# EAGLE design seletor (EAGLE 7.6.0)

## Sheet 1 of 2
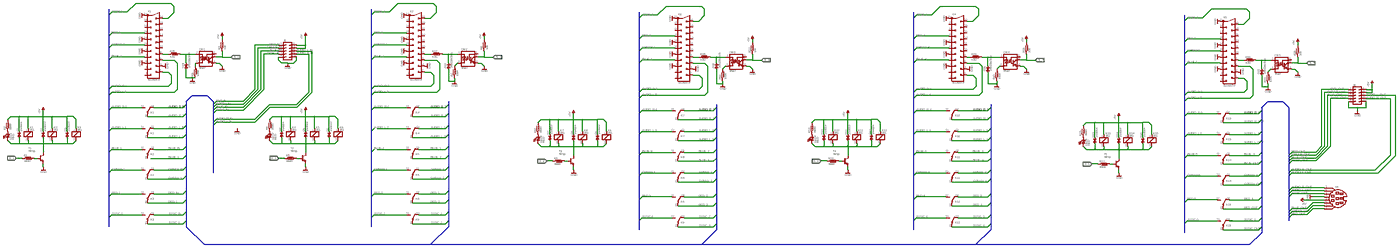
[diagram p0: schematic, sheet 1, overview]
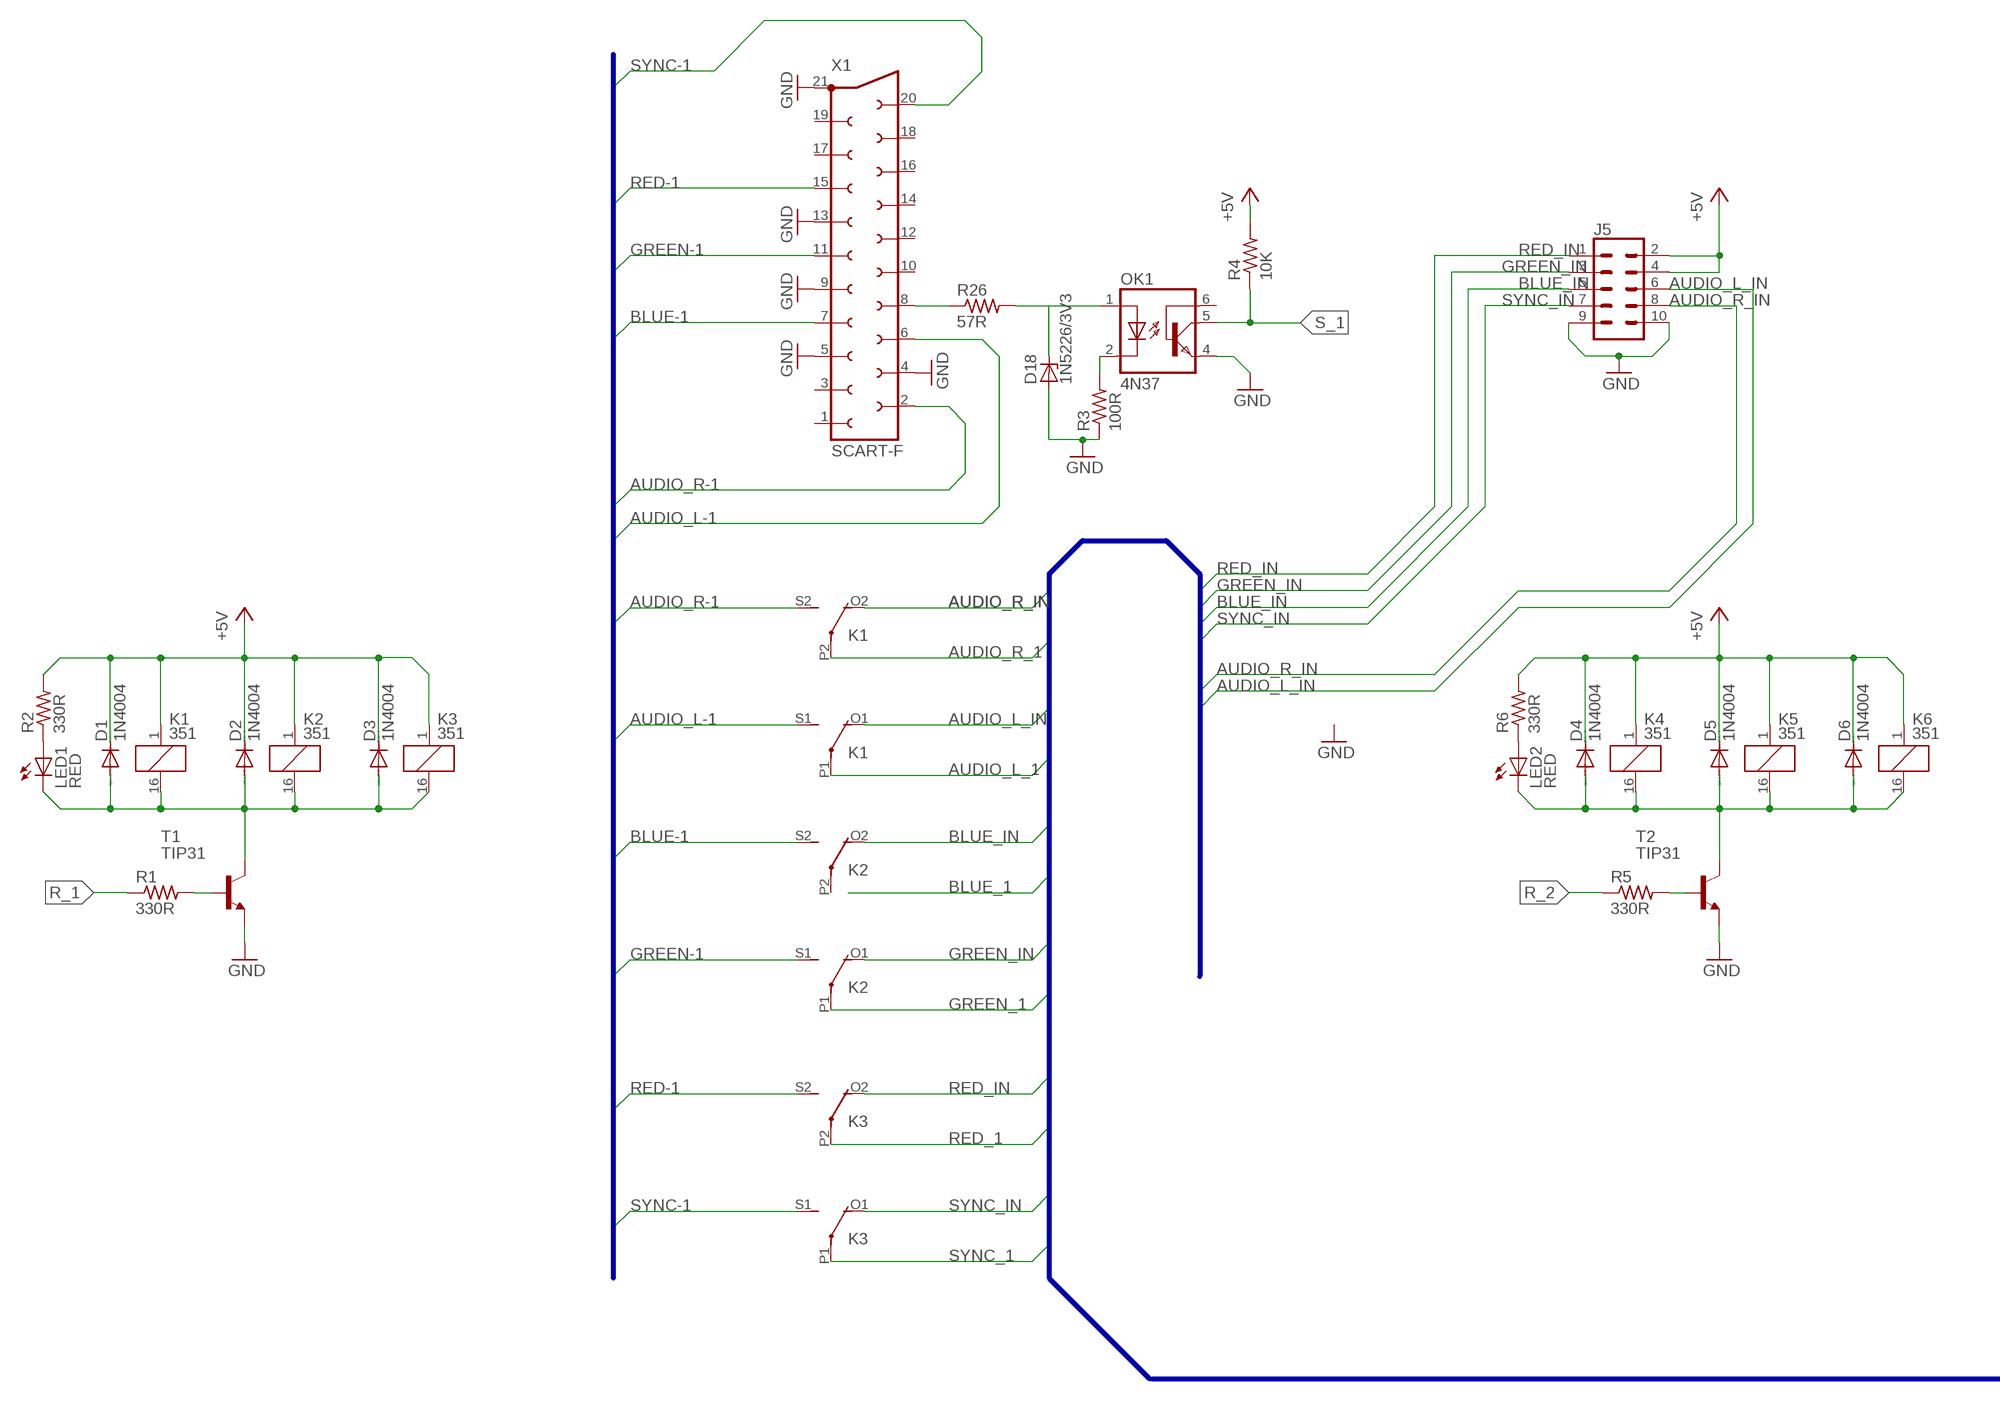
[diagram p1: schematic, sheet 1, part 1 of 4]
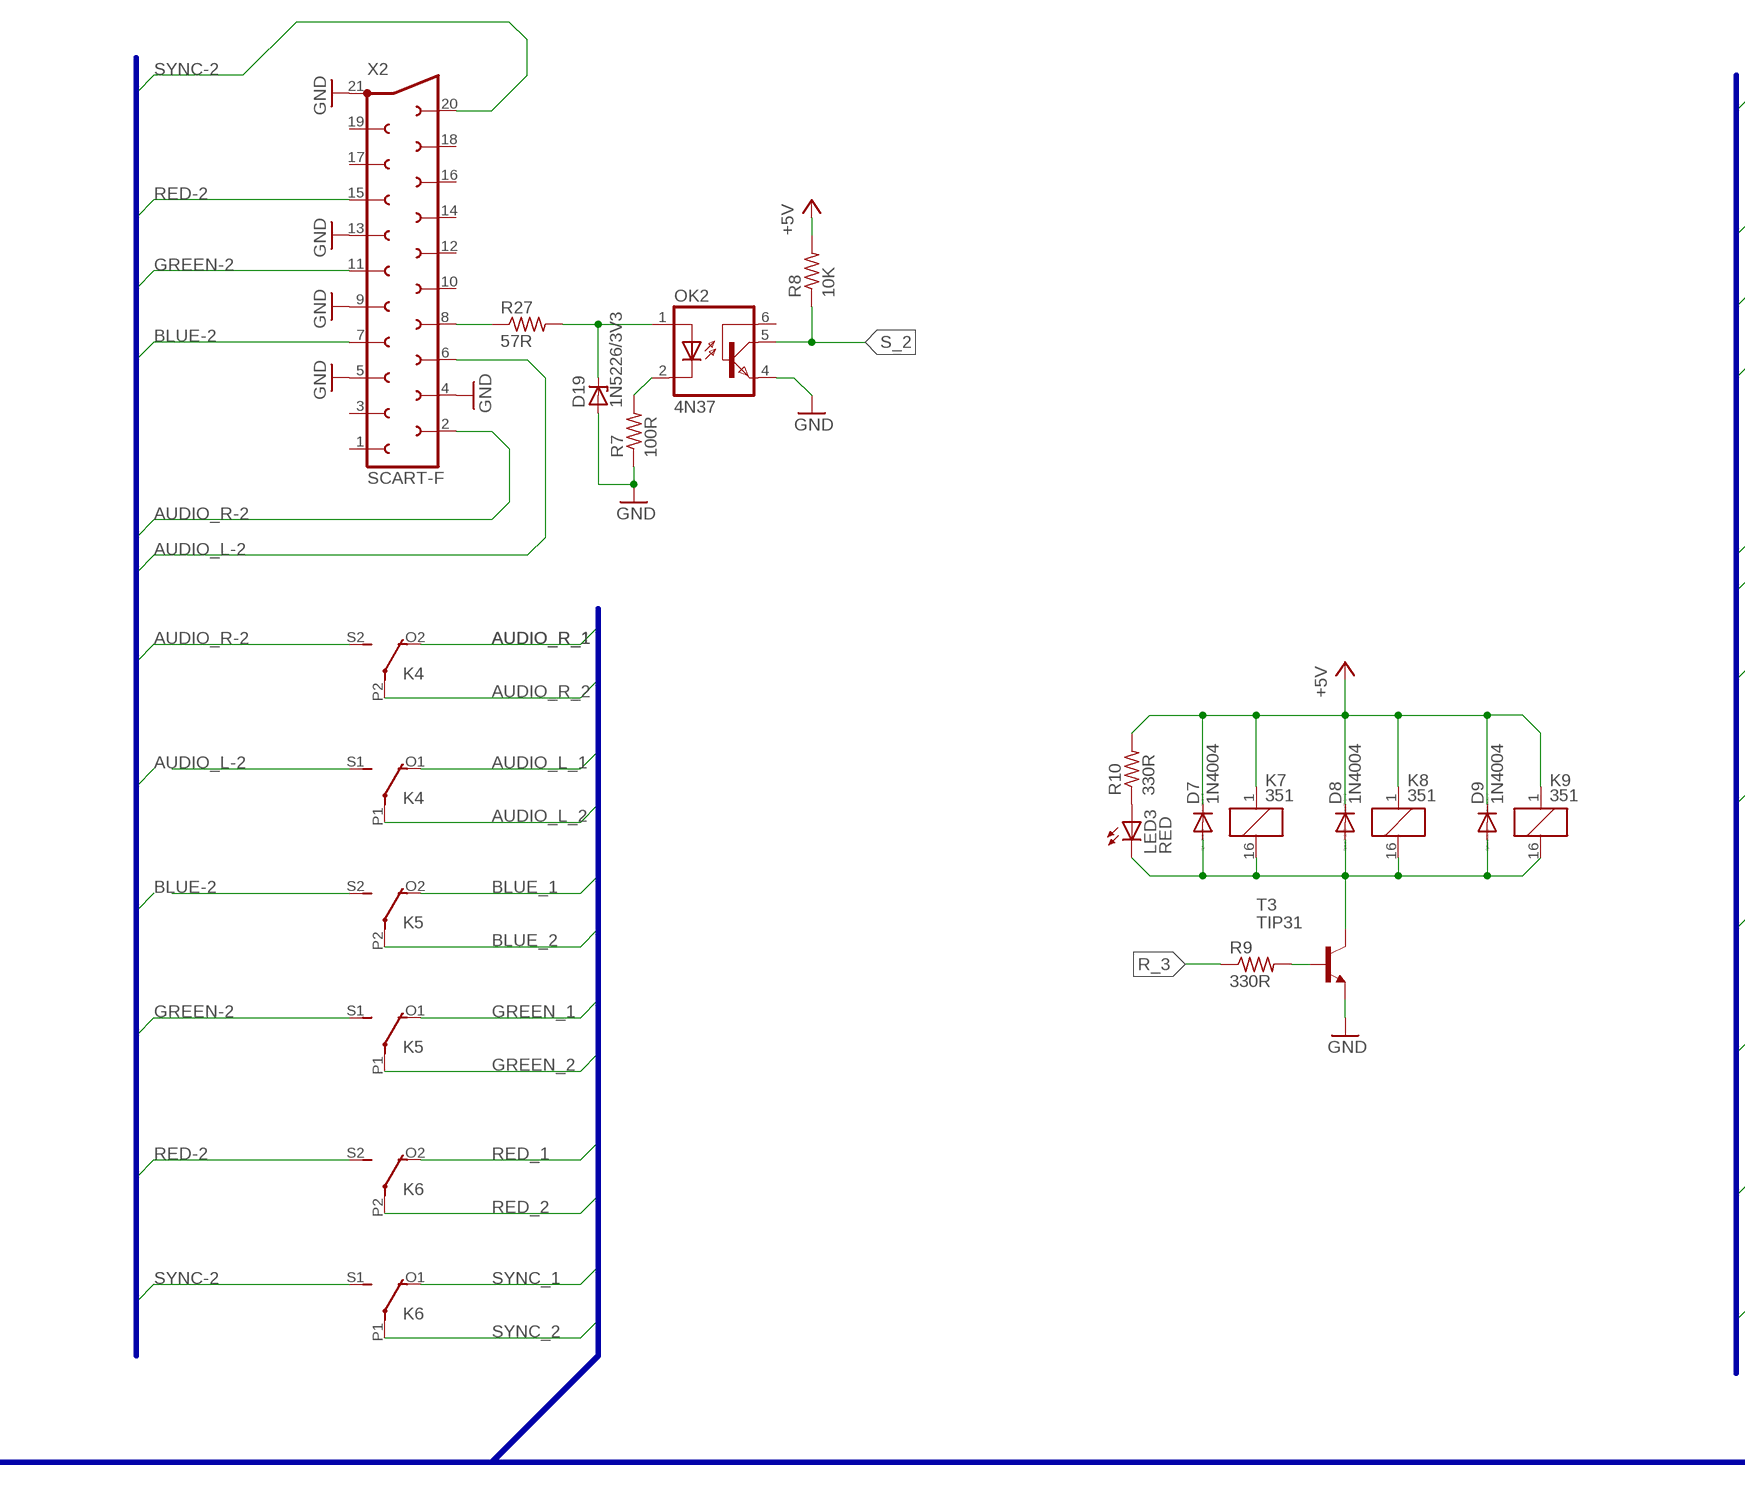
[diagram p2: schematic, sheet 1, part 2 of 4]
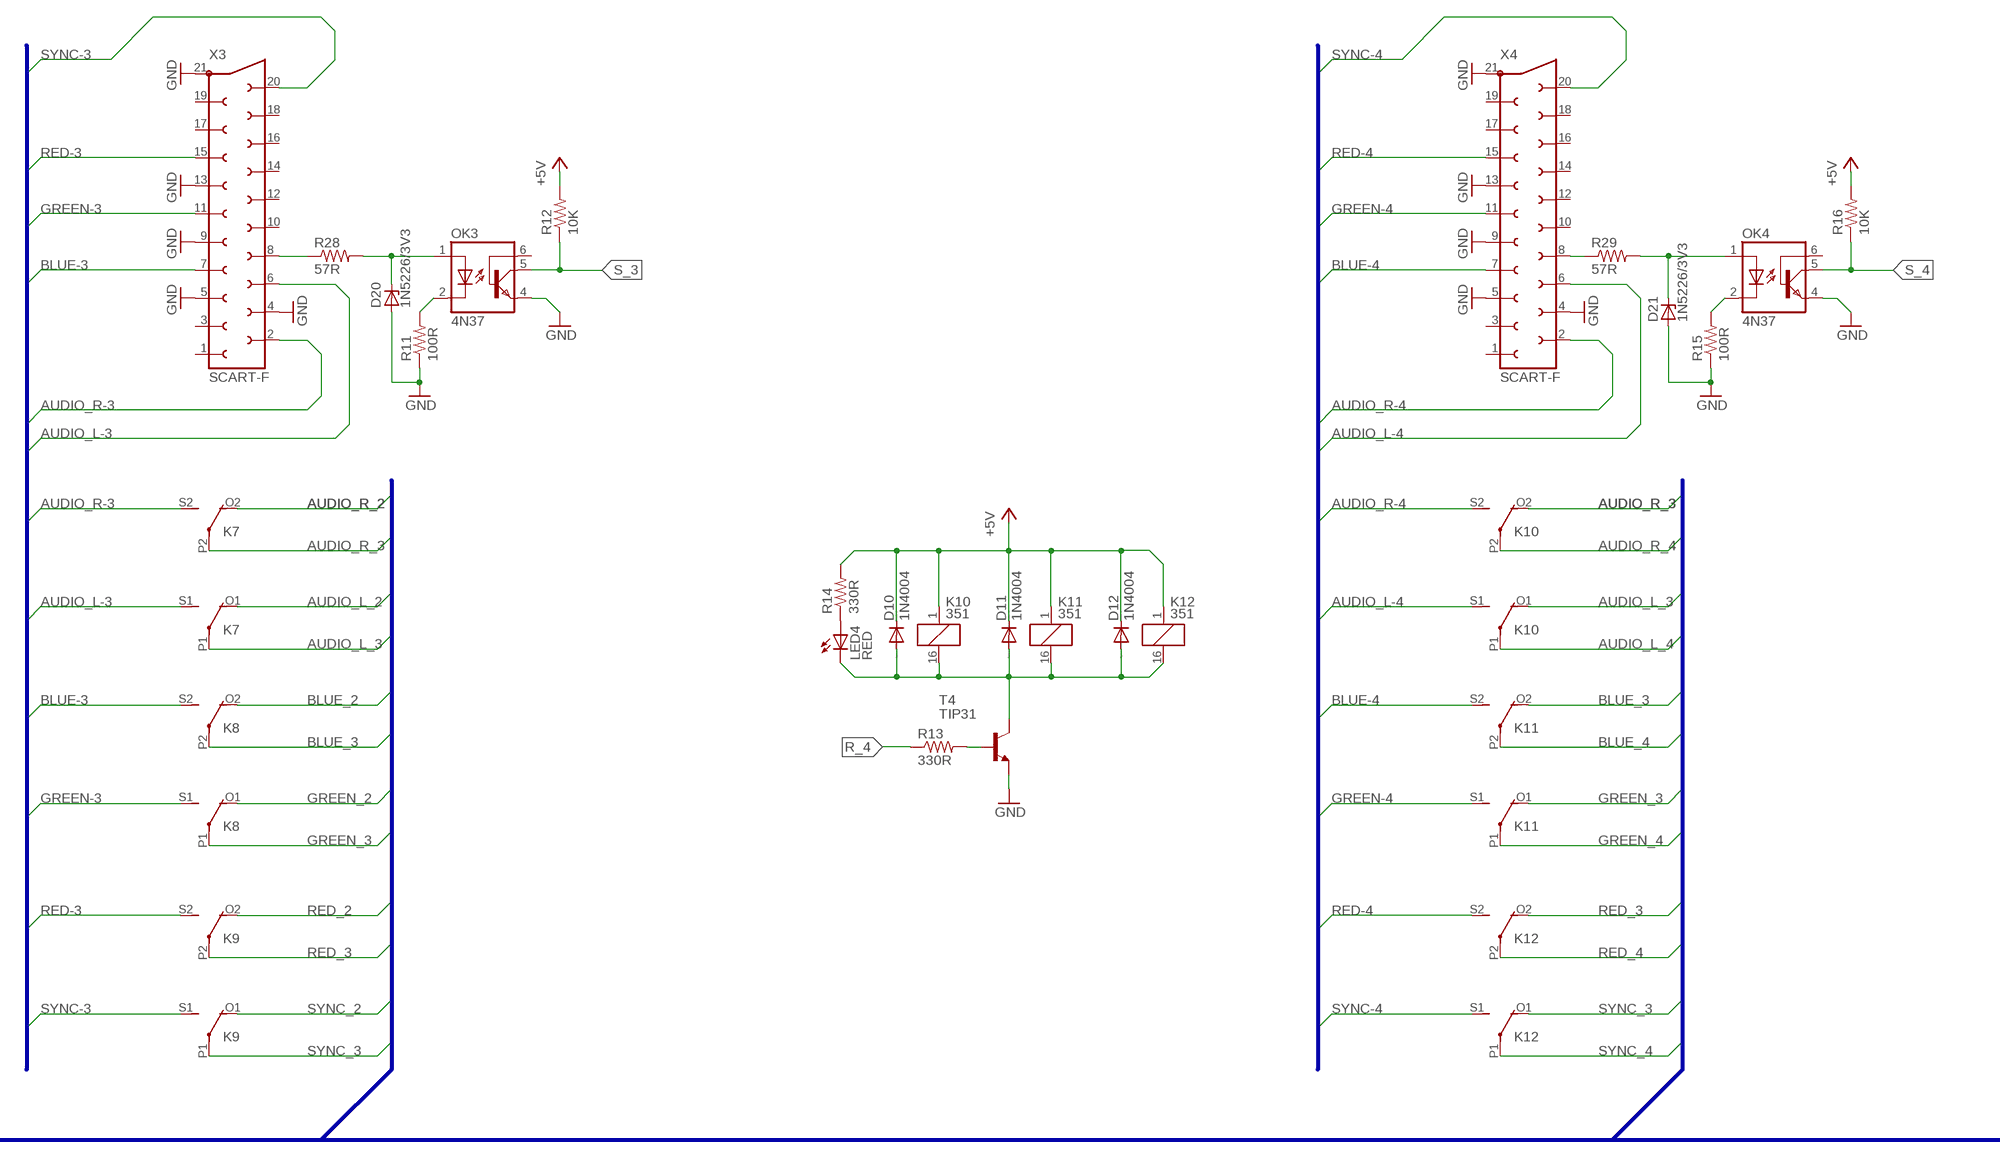
[diagram p3: schematic, sheet 1, part 3 of 4]
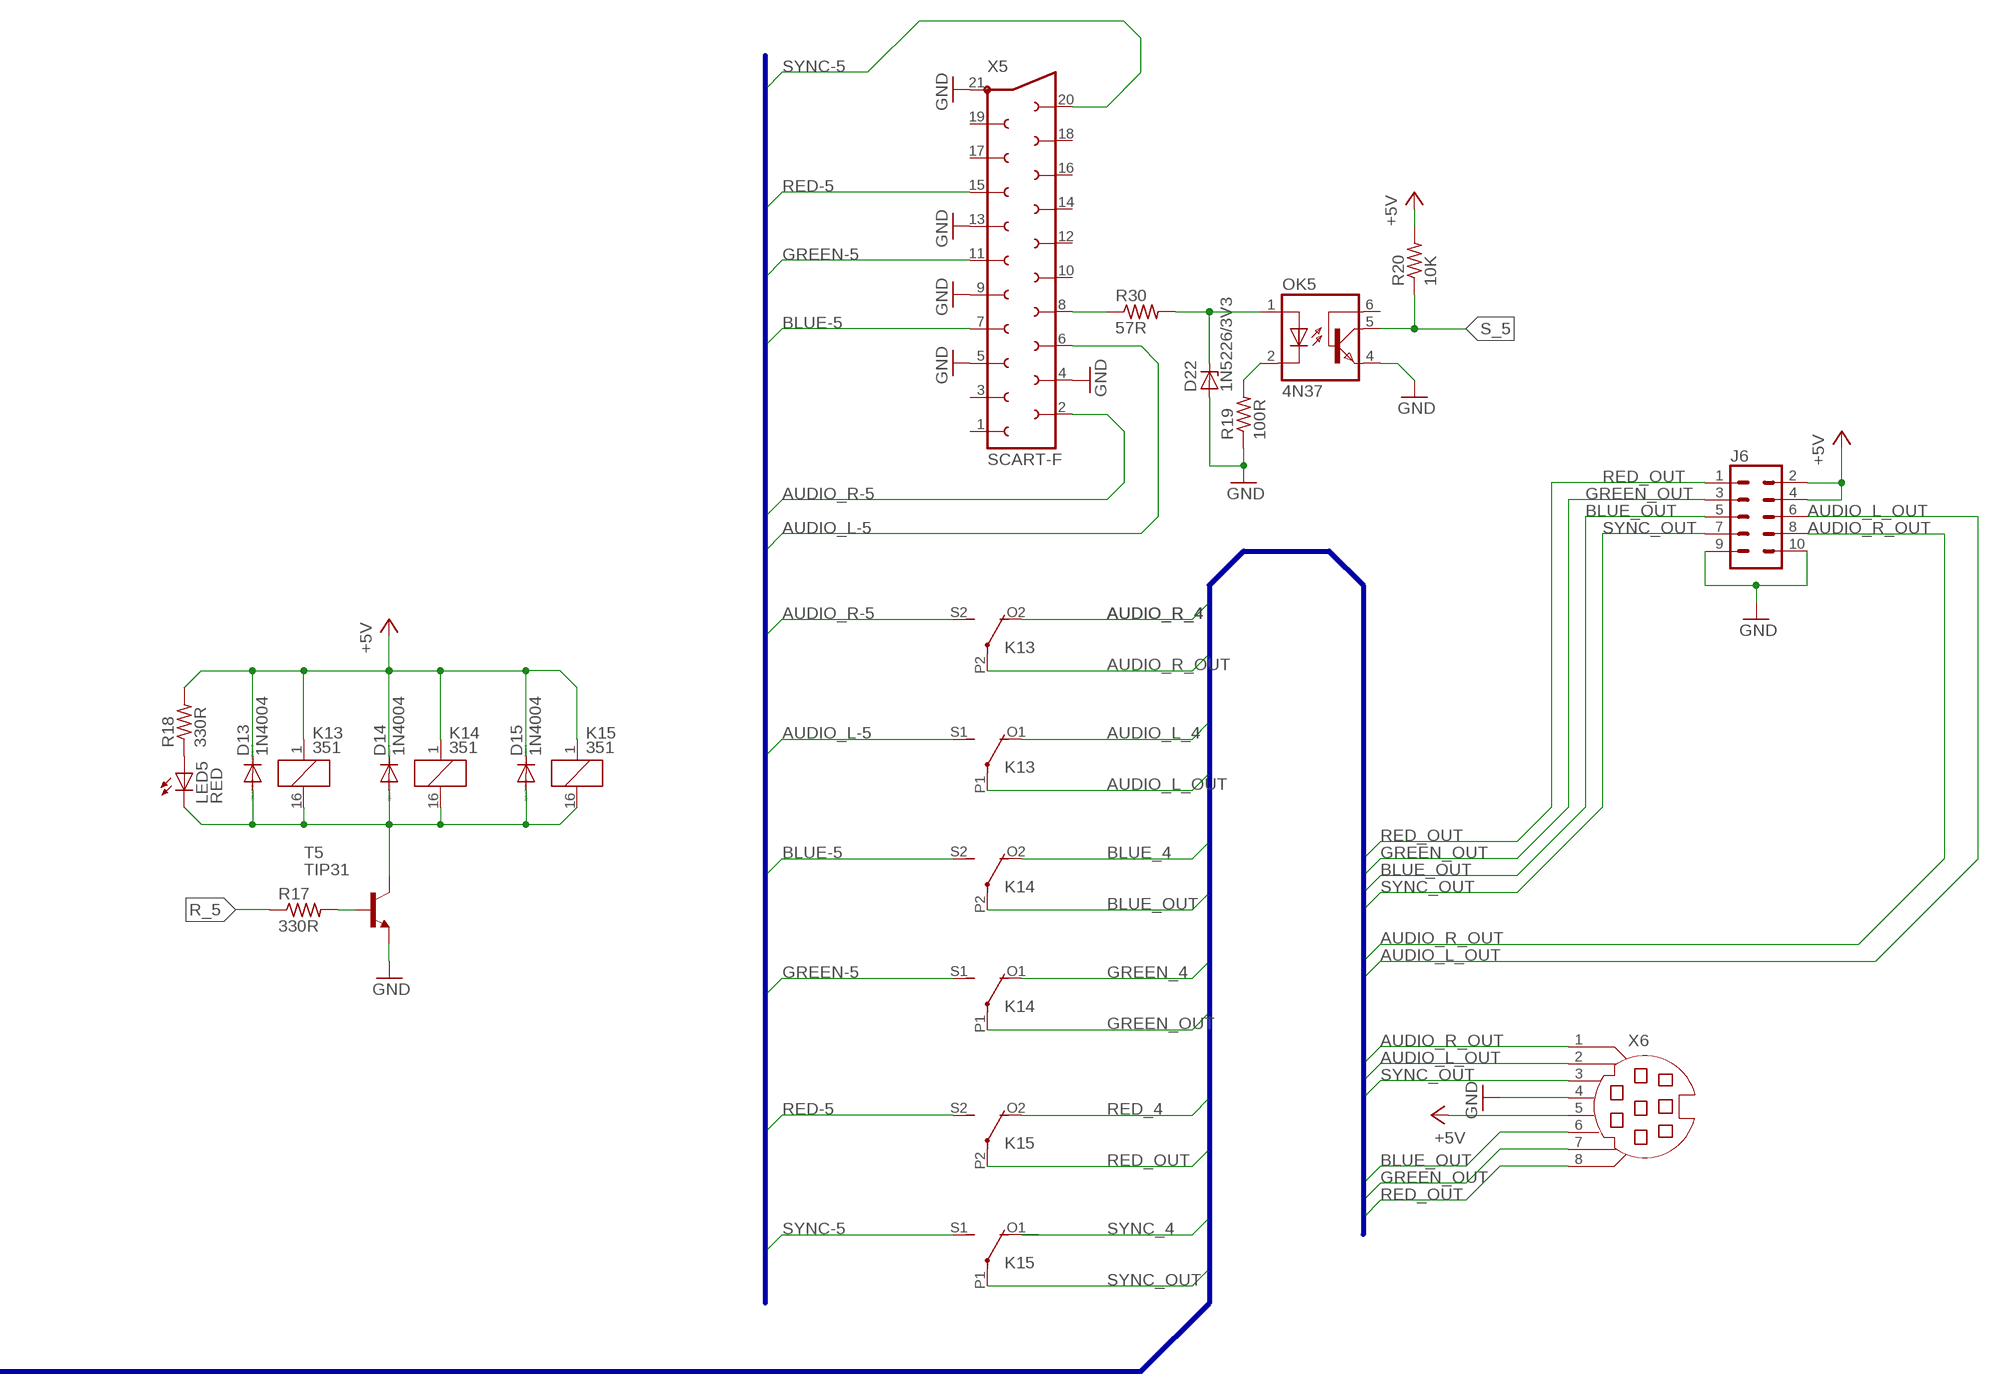
[diagram p4: schematic, sheet 1, part 4 of 4]

### Parts
D1  1N4004  [DO41-10]
D2  1N4004  [DO41-10]
D3  1N4004  [DO41-10]
D4  1N4004  [DO41-10]
D5  1N4004  [DO41-10]
D6  1N4004  [DO41-10]
D7  1N4004  [DO41-10]
D8  1N4004  [DO41-10]
D9  1N4004  [DO41-10]
D10  1N4004  [DO41-10]
D11  1N4004  [DO41-10]
D12  1N4004  [DO41-10]
D13  1N4004  [DO41-10]
D14  1N4004  [DO41-10]
D15  1N4004  [DO41-10]
D18  1N5226/3V3  BZV10  [DO34Z7]
D19  1N5226/3V3  BZV10  [DO34Z7]
D20  1N5226/3V3  BZV10  [DO34Z7]
D21  1N5226/3V3  BZV10  [DO34Z7]
D22  1N5226/3V3  BZV10  [DO34Z7]
J5  CONN_05X2SHD  [2X5-SHROUDED]
J6  CONN_05X2SHD  [2X5-SHROUDED]
K1  351  [351]
K2  351  [351]
K3  351  [351]
K4  351  [351]
K5  351  [351]
K6  351  [351]
K7  351  [351]
K8  351  [351]
K9  351  [351]
K10  351  [351]
K11  351  [351]
K12  351  [351]
K13  351  [351]
K14  351  [351]
K15  351  [351]
LED1  RED  LED5MM  [LED5MM]
LED2  RED  LED5MM  [LED5MM]
LED3  RED  LED5MM  [LED5MM]
LED4  RED  LED5MM  [LED5MM]
LED5  RED  LED5MM  [LED5MM]
OK1  4N37  [DIL06]
OK2  4N37  [DIL06]
OK3  4N37  [DIL06]
OK4  4N37  [DIL06]
OK5  4N37  [DIL06]
R1  330R  R-US_0204/7  [0204/7]
R2  330R  R-US_0204/2V  [0204V]
R3  100R  R-US_0204/2V  [0204V]
R4  10K  R-US_0204/2V  [0204V]
R5  330R  R-US_0204/7  [0204/7]
R6  330R  R-US_0204/2V  [0204V]
R7  100R  R-US_0204/2V  [0204V]
R8  10K  R-US_0204/2V  [0204V]
R9  330R  R-US_0204/7  [0204/7]
R10  330R  R-US_0204/2V  [0204V]
R11  100R  R-US_0204/2V  [0204V]
R12  10K  R-US_0204/2V  [0204V]
R13  330R  R-US_0204/7  [0204/7]
R14  330R  R-US_0204/2V  [0204V]
R15  100R  R-US_0204/2V  [0204V]
R16  10K  R-US_0204/2V  [0204V]
R17  330R  R-US_0204/7  [0204/7]
R18  330R  R-US_0204/2V  [0204V]
R19  100R  R-US_0204/2V  [0204V]
R20  10K  R-US_0204/2V  [0204V]
R26  57R  R-US_0204/7  [0204/7]
R27  57R  R-US_0204/7  [0204/7]
R28  57R  R-US_0204/7  [0204/7]
R29  57R  R-US_0204/7  [0204/7]
R30  57R  R-US_0204/7  [0204/7]
T1  TIP31  [TO220]
T2  TIP31  [TO220]
T3  TIP31  [TO220]
T4  TIP31  [TO220]
T5  TIP31  [TO220]
X1  SCART-F  [SCART-F]
X2  SCART-F  [SCART-F]
X3  SCART-F  [SCART-F]
X4  SCART-F  [SCART-F]
X5  SCART-F  [SCART-F]
X6  MD08SS  [MDIN08SS]

### Nets
+5V: D1.C D2.C D3.C D4.C D5.C D6.C D7.C D8.C D9.C D10.C D11.C D12.C D13.C D14.C D15.C J5.2 J5.4 J6.2 J6.4 K1.1 K2.1 K3.1 K4.1 K5.1 K6.1 K7.1 K8.1 K9.1 K10.1 K11.1 K12.1 K13.1 K14.1 K15.1 R2.2 R4.2 R6.2 R8.2 R10.2 R12.2 R14.2 R16.2 R18.2 R20.2 X6.5 ; also sheet 2
AUDIO_L-1 [singal]: K1.S1(2:S) X1.6
AUDIO_L-2 [singal]: X2.6
AUDIO_L-3 [singal]: K7.S1(2:S) X3.6
AUDIO_L-4 [singal]: K10.S1(2:S) X4.6
AUDIO_L-5 [singal]: K13.S1(2:S) X5.6
AUDIO_L_1 [singal]: K1.P1(2:P) K4.O1(2:O)
AUDIO_L_2 [singal]: K4.P1(2:P) K7.O1(2:O)
AUDIO_L_3 [singal]: K7.P1(2:P) K10.O1(2:O)
AUDIO_L_4 [singal]: K10.P1(2:P) K13.O1(2:O)
AUDIO_L_IN [singal]: J5.6 K1.O1(2:O)
AUDIO_L_OUT [singal]: J6.6 K13.P1(2:P) X6.2
AUDIO_R-1 [singal]: K1.S2(3:S) X1.2
AUDIO_R-2 [singal]: K4.S2(3:S) X2.2
AUDIO_R-3 [singal]: K7.S2(3:S) X3.2
AUDIO_R-4 [singal]: K10.S2(3:S) X4.2
AUDIO_R-5 [singal]: K13.S2(3:S) X5.2
AUDIO_R_1 [singal]: K1.P2(3:P) K4.O2(3:O)
AUDIO_R_2 [singal]: K4.P2(3:P) K7.O2(3:O)
AUDIO_R_3 [singal]: K7.P2(3:P) K10.O2(3:O)
AUDIO_R_4 [singal]: K10.P2(3:P) K13.O2(3:O)
AUDIO_R_IN [singal]: J5.8 K1.O2(3:O)
AUDIO_R_OUT [singal]: J6.8 K13.P2(3:P) X6.1
BLUE-1 [singal]: K2.S2(3:S) X1.7
BLUE-2 [singal]: X2.7
BLUE-3 [singal]: K8.S2(3:S) X3.7
BLUE-4 [singal]: K11.S2(3:S) X4.7
BLUE-5 [singal]: K14.S2(3:S) X5.7
BLUE_1 [singal]: K5.O2(3:O)
BLUE_2 [singal]: K5.P2(3:P) K8.O2(3:O)
BLUE_3 [singal]: K8.P2(3:P) K11.O2(3:O)
BLUE_4 [singal]: K11.P2(3:P) K14.O2(3:O)
BLUE_IN [singal]: J5.5 K2.O2(3:O)
BLUE_OUT [singal]: J6.5 K14.P2(3:P) X6.6
GND: D18.A D19.A D20.A D21.A D22.A J5.9 J5.10 J6.9 J6.10 OK1.4(EMI) OK2.4(EMI) OK3.4(EMI) OK4.4(EMI) OK5.4(EMI) R3.1 R7.1 R11.1 R15.1 R19.1 T1.3(E) T2.3(E) T3.3(E) T4.3(E) T5.3(E) X1.4 X1.5 X1.9 X1.13 X1.21 X2.4 X2.5 X2.9 X2.13 X2.21 X3.4 X3.5 X3.9 X3.13 X3.21 X4.4 X4.5 X4.9 X4.13 X4.21 X5.4 X5.5 X5.9 X5.13 X5.21 X6.4 ; also sheet 2
GREEN-1 [singal]: K2.S1(2:S) X1.11
GREEN-2 [singal]: K5.S1(2:S) X2.11
GREEN-3 [singal]: K8.S1(2:S) X3.11
GREEN-4 [singal]: K11.S1(2:S) X4.11
GREEN-5 [singal]: K14.S1(2:S) X5.11
GREEN_1 [singal]: K2.P1(2:P) K5.O1(2:O)
GREEN_2 [singal]: K5.P1(2:P) K8.O1(2:O)
GREEN_3 [singal]: K8.P1(2:P) K11.O1(2:O)
GREEN_4 [singal]: K11.P1(2:P) K14.O1(2:O)
GREEN_IN [singal]: J5.3 K2.O1(2:O)
GREEN_OUT [singal]: J6.3 K14.P1(2:P) X6.7
N$2: D1.A D2.A D3.A K1.16 K2.16 K3.16 LED1.K(C) T1.2(C)
N$3: LED1.A R2.1
N$4: R26.1 X1.8
N$5: OK1.2(C) R3.2
N$6: D4.A D5.A D6.A K4.16 K5.16 K6.16 LED2.K(C) T2.2(C)
N$7: R1.2 T1.1(B)
N$8: LED2.A R6.1
N$9: R5.2 T2.1(B)
N$11: R27.1 X2.8
N$12: OK2.2(C) R7.2
N$13: D7.A D8.A D9.A K7.16 K8.16 K9.16 LED3.K(C) T3.2(C)
N$14: LED3.A R10.1
N$15: R9.2 T3.1(B)
N$17: R28.1 X3.8
N$18: OK3.2(C) R11.2
N$19: D10.A D11.A D12.A K10.16 K11.16 K12.16 LED4.K(C) T4.2(C)
N$20: LED4.A R14.1
N$21: R13.2 T4.1(B)
N$23: R29.1 X4.8
N$24: OK4.2(C) R15.2
N$25: D13.A D14.A D15.A K13.16 K14.16 K15.16 LED5.K(C) T5.2(C)
N$26: LED5.A R18.1
N$27: R17.2 T5.1(B)
N$28: K4.S1(2:S)
N$29: R30.1 X5.8
N$30: OK5.2(C) R19.2
N$37: K5.S2(3:S)
N$38: D22.C OK5.1(A) R30.2
N$41: D21.C OK4.1(A) R29.2
N$42: D20.C OK3.1(A) R28.2
N$43: D18.C OK1.1(A) R26.2
N$44: D19.C OK2.1(A) R27.2
R_1: R1.1 ; also sheet 2
R_2: R5.1 ; also sheet 2
R_3: R9.1 ; also sheet 2
R_4: R13.1 ; also sheet 2
R_5: R17.1 ; also sheet 2
RED-1 [singal]: K3.S2(3:S) X1.15
RED-2 [singal]: K6.S2(3:S) X2.15
RED-3 [singal]: K9.S2(3:S) X3.15
RED-4 [singal]: K12.S2(3:S) X4.15
RED-5 [singal]: K15.S2(3:S) X5.15
RED_1 [singal]: K3.P2(3:P) K6.O2(3:O)
RED_2 [singal]: K6.P2(3:P) K9.O2(3:O)
RED_3 [singal]: K9.P2(3:P) K12.O2(3:O)
RED_4 [singal]: K12.P2(3:P) K15.O2(3:O)
RED_IN [singal]: J5.1 K3.O2(3:O)
RED_OUT [singal]: J6.1 K15.P2(3:P) X6.8
S_1: OK1.5(COL) R4.1 ; also sheet 2
S_2: OK2.5(COL) R8.1 ; also sheet 2
S_3: OK3.5(COL) R12.1 ; also sheet 2
S_4: OK4.5(COL) R16.1 ; also sheet 2
S_5: OK5.5(COL) R20.1 ; also sheet 2
SYNC-1 [singal]: K3.S1(2:S) X1.20
SYNC-2 [singal]: K6.S1(2:S) X2.20
SYNC-3 [singal]: K9.S1(2:S) X3.20
SYNC-4 [singal]: K12.S1(2:S) X4.20
SYNC-5 [singal]: K15.S1(2:S) X5.20
SYNC_1 [singal]: K3.P1(2:P) K6.O1(2:O)
SYNC_2 [singal]: K6.P1(2:P) K9.O1(2:O)
SYNC_3 [singal]: K9.P1(2:P) K12.O1(2:O)
SYNC_4 [singal]: K12.P1(2:P) K15.O1(2:O)
SYNC_IN [singal]: J5.7 K3.O1(2:O)
SYNC_OUT [singal]: J6.7 K15.P1(2:P) X6.3
Unconnected: K2.P2(3:P) OK1.6(BAS) OK2.6(BAS) OK3.6(BAS) OK4.6(BAS) OK5.6(BAS) X1.1 X1.3 X1.10 X1.12 X1.14 X1.16 X1.17 X1.18 X1.19 X2.1 X2.3 X2.10 X2.12 X2.14 X2.16 X2.17 X2.18 X2.19 X3.1 X3.3 X3.10 X3.12 X3.14 X3.16 X3.17 X3.18 X3.19 X4.1 X4.3 X4.10 X4.12 X4.14 X4.16 X4.17 X4.18 X4.19 X5.1 X5.3 X5.10 X5.12 X5.14 X5.16 X5.17 X5.18 X5.19

### Buses
B$1
B$2

## Sheet 2 of 2
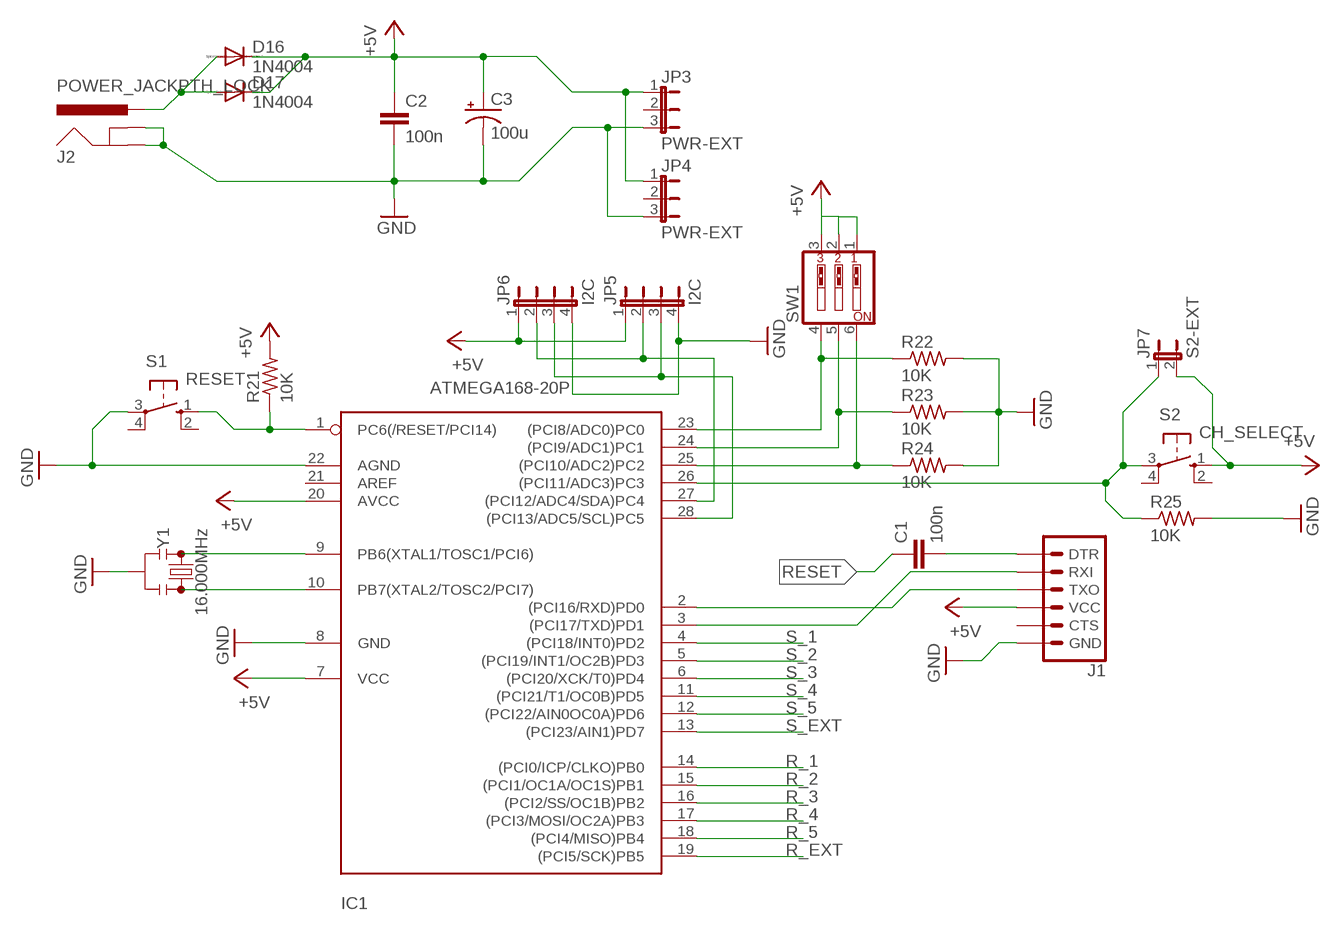
[diagram p5: schematic, sheet 2]

### Parts
C1  100n  C7.5/3  [C7.5B3]
C2  100n  C7.5/3  [C7.5B3]
C3  100u  CPOL-USE3.5-10  [E3,5-10]
D16  1N4004  [DO41-10]
D17  1N4004  [DO41-10]
IC1  ATMEGA168-20P  [DIL28-3]
J1  6_PIN_SERIAL_TARGETSILK  [6_PIN_SERIAL_TARGET_SIDE_W_SILK]
J2  POWER_JACKPTH_LOCK  [POWER_JACK_PTH_LOCK]
JP3  PWR-EXT  JP2E  [JP2]
JP4  PWR-EXT  JP2E  [JP2]
JP5  I2C  JP4E  [JP4]
JP6  I2C  JP4E  [JP4]
JP7  S2-EXT  JP1E  [JP1]
R21  10K  R-US_0204/7  [0204/7]
R22  10K  R-US_0204/7  [0204/7]
R23  10K  R-US_0204/7  [0204/7]
R24  10K  R-US_0204/7  [0204/7]
R25  10K  R-US_0204/7  [0204/7]
S1  RESET  10-XX  [B3F-10XX]
S2  CH_SELECT  10-XX  [B3F-10XX]
SW1  SW_DIP-3  [EDG-03]
Y1  16.000MHz  RESONATORPTH-7.6X3.8  [RESONATOR-PTH-7.6X3.8]

### Nets
+5V: C2.1 C3.+ D16.C D17.C IC1.7(VCC) IC1.20(AVCC) J1.P$4(VCC) JP3.1 JP4.1 JP5.1 JP6.1 JP7.2 R21.2 S2.1(S) SW1.1 SW1.2 SW1.3 ; also sheet 1
GND: C2.2 C3.- IC1.8(GND) IC1.22(AGND) J1.P$6(GND) J2.GND J2.GNDBREAK JP3.3 JP4.3 JP5.4 JP6.4 R22.2 R23.2 R24.2 R25.2 S1.3(P) Y1.2 ; also sheet 1
N$1: IC1.2((PCI16/RXD)PD0) J1.P$2(TXO)
N$10: IC1.3((PCI17/TXD)PD1) J1.P$3(RXI)
N$16: D16.A D17.A J2.PWR
N$22: C1.2 J1.P$1(DTR)
N$31: IC1.9(PB6(XTAL1/TOSC1/PCI6)) Y1.1
N$32: IC1.10(PB7(XTAL2/TOSC2/PCI7)) Y1.3
N$33: IC1.26((PCI11/ADC3)PC3) JP7.1 R25.1 S2.3(P)
N$34: IC1.25((PCI10/ADC2)PC2) R24.1 SW1.6
N$35: IC1.24((PCI9/ADC1)PC1) R23.1 SW1.5
N$36: IC1.23((PCI8/ADC0)PC0) R22.1 SW1.4
N$39: IC1.27((PCI12/ADC4/SDA)PC4) JP5.2 JP6.2
N$40: IC1.28((PCI13/ADC5/SCL)PC5) JP5.3 JP6.3
R_1: IC1.14((PCI0/ICP/CLKO)PB0) ; also sheet 1
R_2: IC1.15((PCI1/OC1A/OC1S)PB1) ; also sheet 1
R_3: IC1.16((PCI2/SS/OC1B)PB2) ; also sheet 1
R_4: IC1.17((PCI3/MOSI/OC2A)PB3) ; also sheet 1
R_5: IC1.18((PCI4/MISO)PB4) ; also sheet 1
R_EXT: IC1.19((PCI5/SCK)PB5)
RESET: C1.1 IC1.1(PC6(/RESET/PCI14)) R21.1 S1.1(S)
S_1: IC1.4((PCI18/INT0)PD2) ; also sheet 1
S_2: IC1.5((PCI19/INT1/OC2B)PD3) ; also sheet 1
S_3: IC1.6((PCI20/XCK/T0)PD4) ; also sheet 1
S_4: IC1.11((PCI21/T1/OC0B)PD5) ; also sheet 1
S_5: IC1.12((PCI22/AIN0OC0A)PD6) ; also sheet 1
S_EXT: IC1.13((PCI23/AIN1)PD7)
Unconnected: IC1.21(AREF) J1.P$5(CTS) JP3.2 JP4.2 S1.2(S1) S1.4(P1) S2.2(S1) S2.4(P1)

## Library data of the parts
C1 C2 = capacitor-wima:C: CAPACITOR naming: grid - package width
C3 = rcl:CPOL-US: POLARIZED CAPACITOR, American symbol
D1-D17 = diode:1N4004: DIODE general purpose rectifier, 1 A
D18-D22 = diode:BZV10: Z DIODE
IC1 = adafruit:ATMEGA168*P: MICROCONTROLLER 16 kBytes FLASH 1 kBytes SRAM 512 Bytes EEPROM USART 8-channel 10 bit ADC
J1 = SparkFun-Connectors:6_PIN_SERIAL_TARGET: 6-pin header connection for use with the "FTDI BASIC" pinout - TARGET SIDE. Also known as "Arduino Serial Program Header". It is used to mate with our FTDI Basic serial programmers using the Arduino IDE. Note, this device has "TARGET" in the name. It is intended to be used on a design that contains a target micro-controller that you wish to program. The "sister" device, named "CABLE" is inteneded to be used on a design that usually lives on the end of your USB cable and prvides the converter chip (FTDI232 or FTDI231x) to commnicate serial RX/TX. You can populate with some of these: Break Away Headers - Straight <https://www.sparkfun.com/products/116> (PRT-00116) For reference (or to suit your programming needs) check out these designs: SparkFun FTDI Basic Breakout - 5V <https://www.sparkfun.com/products/9716> (DEV-09716) SparkFun FTDI Basic Breakout - 3.3V <https://www.sparkfun.com/products/9873> (DEV-09873) SparkFun FTDI SmartBasic <https://www.sparkfun.com/products/12935> (DEV-12935) SparkFun Beefy 3 - FTDI Basic Breakout <https://www.sparkfun.com/products/13746> (DEV-13746)
J2 = SparkFun-Connectors:POWER_JACK: Power Jack Connector This is the standard 5.5mm barrel jack for power. The PTH is the most common, proven, reliable, footprint. The Slot footprint only works if the mill layer is transmitted to the PCB fab house so be warned. Here are the connectors we sell at SparkFun: DC Barrel Power Jack/Connector <https://www.sparkfun.com/products/119> (PRT-00119) DC Barrel Power Jack/Connector (SMD) <https://www.sparkfun.com/products/12748> (PRT-12748) DC Barrel Jack Adapter - Breadboard Compatible <https://www.sparkfun.com/products/10811> (PRT-10811) It is used on this SparkFun product (and many, many others): SparkFun RedBoard - Programmed with Arduino <https://www.sparkfun.com/products/12757> (DEV-12757) Also, if you need a mating power supply or connector, please check these out: Wall Adapter Power Supply - 9VDC 650mA <https://www.sparkfun.com/products/298> (TOL-00298) DC Barrel Jack Adapter - Male <https://www.sparkfun.com/products/10287> (PRT-10287); PROD_ID: CONN-08197; SF_ID: PRT-00119
J5 J6 = SparkFun-Connectors:CONN_05X2: Multi connection point. Often used as Generic Header-pin footprint for 0.1 inch spaced/style header connections For AVR SPI programming port, see special device with nice symbol: "AVR_SPI_PROG_5x2.dev" You can populate with any combo of single row headers, but if you'd like an exact match, check these: 2x5 AVR ICSP Male Header <https://www.sparkfun.com/products/778> (PRT-00778) 2x5 Pin Shrouded Header <https://www.sparkfun.com/products/8506> (PRT-08506) On any of the 0.1 inch spaced packages, you can populate with these: Break Away Headers - Straight <https://www.sparkfun.com/products/116> (PRT-00116) Break Away Male Headers - Right Angle <https://www.sparkfun.com/products/553> (PRT-00553) Female Headers <https://www.sparkfun.com/products/115> (PRT-00115) Break Away Headers - Machine Pin <https://www.sparkfun.com/products/117> (PRT-00117) Break Away Female Headers - Swiss Machine Pin <https://www.sparkfun.com/products/743> (PRT-00743) Special note: the shrouded connector mates well with our 5x2 ribbon cables: 2x5 Pin IDC Ribbon Cable <https://www.sparkfun.com/products/8535> (PRT-08535); PROD_ID: CONN-08671; SF_ID: PRT-08506
JP3 JP4 = jumper:JP2E: JUMPER
JP5 JP6 = jumper:JP4E: JUMPER
JP7 = jumper:JP1E: JUMPER
K1-K15 = relay:351: RELAY 2 x switch, Omron; OC_FARNELL: unknown; OC_NEWARK: unknown
LED1-LED5 = led:LED: LED OSRAM: - CHIPLED LG R971, LG N971, LY N971, LG Q971, LY Q971, LO R971, LY R971 LH N974, LH R974 LS Q976, LO Q976, LY Q976 LO Q996 - Hyper CHIPLED LW Q18S LB Q993, LB Q99A, LB R99A - SideLED LS A670, LO A670, LY A670, LG A670, LP A670 LB A673, LV A673, LT A673, LW A673 LH A674 LY A675 LS A676, LA A676, LO A676, LY A676, LW A676 LS A679, LY A679, LG A679 - Hyper Micro SIDELED® LS Y876, LA Y876, LO Y876, LY Y876 LT Y87S - SmartLED LW L88C, LW L88S LB L89C, LB L89S, LG L890 LS L89K, LO L89K, LY L89K LS L896, LA L896, LO L896, LY L896 - TOPLED LS T670, LO T670, LY T670, LG T670, LP T670 LSG T670, LSP T670, LSY T670, LOP T670, LYG T670 LG T671, LOG T671, LSG T671 LB T673, LV T673, LT T673, LW T673 LH T674 LS T676, LA T676, LO T676, LY T676, LB T676, LH T676, LSB T676, LW T676 LB T67C, LV T67C, LT T67C, LS T67K, LO T67K, LY T67K, LW E67C LS E67B, LA E67B, LO E67B, LY E67B, LB E67C, LV E67C, LT E67C LW T67C LS T679, LY T679, LG T679 LS T770, LO T770, LY T770, LG T770, LP T770 LB T773, LV T773, LT T773, LW T773 LH T774 LS E675, LA E675, LY E675, LS T675 LS T776, LA T776, LO T776, LY T776, LB T776 LHGB T686 LT T68C, LB T68C - Hyper Mini TOPLED® LB M676 - Mini TOPLED Santana® LG M470 LS M47K, LO M47K, LY M47K Source: http://www.osram.convergy.de LUXEON: - LUMILED® LXK2-PW12-R00, LXK2-PW12-S00, LXK2-PW14-U00, LXK2-PW14-V00 LXK2-PM12-R00, LXK2-PM12-S00, LXK2-PM14-U00 LXK2-PE12-Q00, LXK2-PE12-R00, LXK2-PE12-S00, LXK2-PE14-T00, LXK2-PE14-U00 LXK2-PB12-K00, LXK2-PB12-L00, LXK2-PB12-M00, LXK2-PB14-N00, LXK2-PB14-P00, LXK2-PB14-Q00 LXK2-PR12-L00, LXK2-PR12-M00, LXK2-PR14-Q00, LXK2-PR14-R00 LXK2-PD12-Q00, LXK2-PD12-R00, LXK2-PD12-S00 LXK2-PH12-R00, LXK2-PH12-S00 LXK2-PL12-P00, LXK2-PL12-Q00, LXK2-PL12-R00 Source: www.luxeon.com KINGBRIGHT: KA-3528ASYC Source: www.kingbright.com
OK1-OK5 = optocoupler:4N37: OPTO COUPLER Source: http://www.fairchildsemi.com/pf/4N/4N35-M.html; MF: FAIRCHILD SEMICONDUCTOR; MPN: 4N37; OC_FARNELL: 1612456; OC_NEWARK: 72K9948
R1-R25 = rcl:R-US_: RESISTOR, American symbol
R26-R30 = resistor:R-US_: RESISTOR, American symbol
S1 S2 = switch-omron:10-XX: OMRON SWITCH; MPN: B3F-1000; OC_FARNELL: 176432; OC_NEWARK: 36M3542
SW1 = special:SW_DIP-3: DIP SWITCH
T1-T5 = transistor:TIP31: NPN Transistor Medium Power Linear Switching Applications Source: http://onsemi.com
X1-X5 = con-hirschmann:SCART-F: TV SCART CONNECTOR; OC_FARNELL: unknown; OC_NEWARK: unknown
X6 = con-yamaichi:MD08SS: YAMAICHI CONNECTOR; OC_FARNELL: unknown; OC_NEWARK: unknown
Y1 = SparkFun-Clocks:RESONATOR: Resonators (Generic) Ceramic resonators are clock-generating components, often used to control timing in microcontrollers. They usually have 3 pins: two pins for oscillation, and one pin for ground. Compared to crystals, resonators have worse tolerance, but are usually much cheaper. Plus, they have built-in load capacitors! These devices are used on boards like the Arduino Pro 8MHz <https://www.sparkfun.com/products/11114> and Arduino Pro 16MHz <https://www.sparkfun.com/products/11113>.

## Net classes
0 default: width 0.5 mm
1 singal: width 0.5 mm
2 POWER: width 0.5 mm

## Board
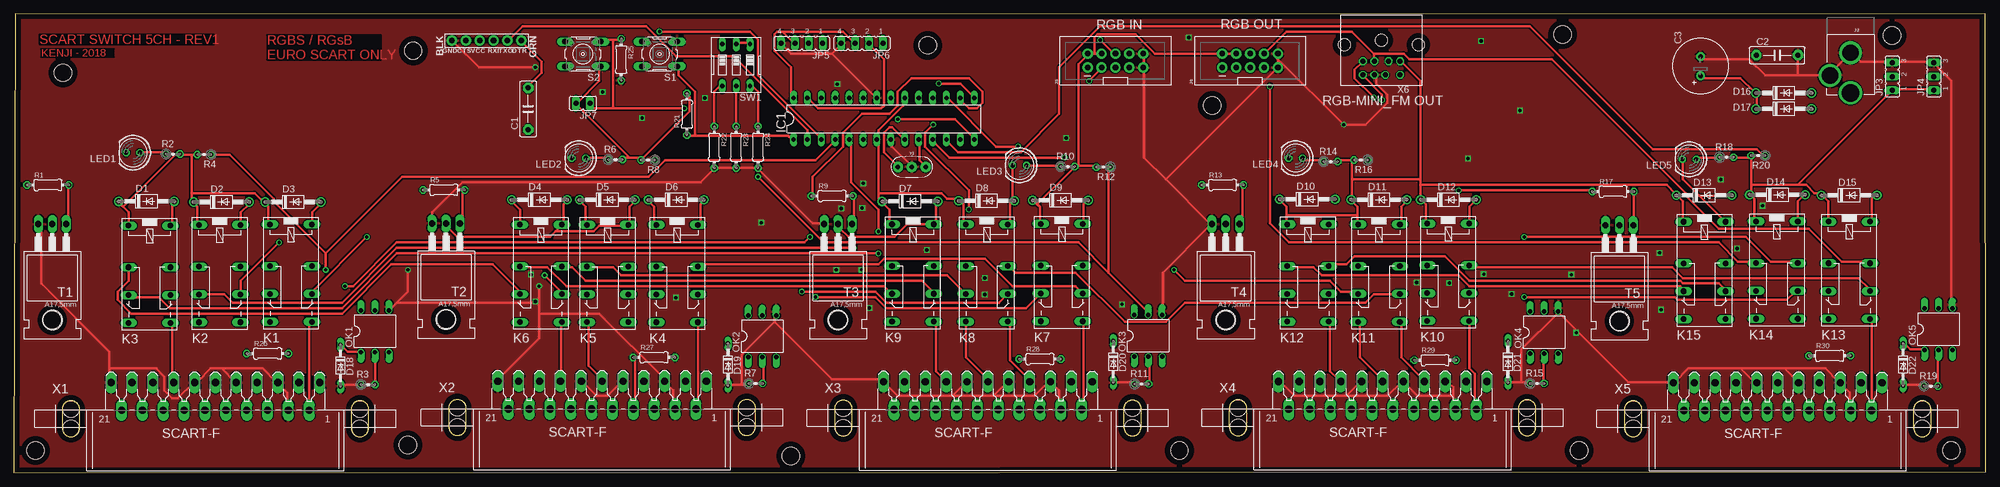
[diagram p6: board, top side]
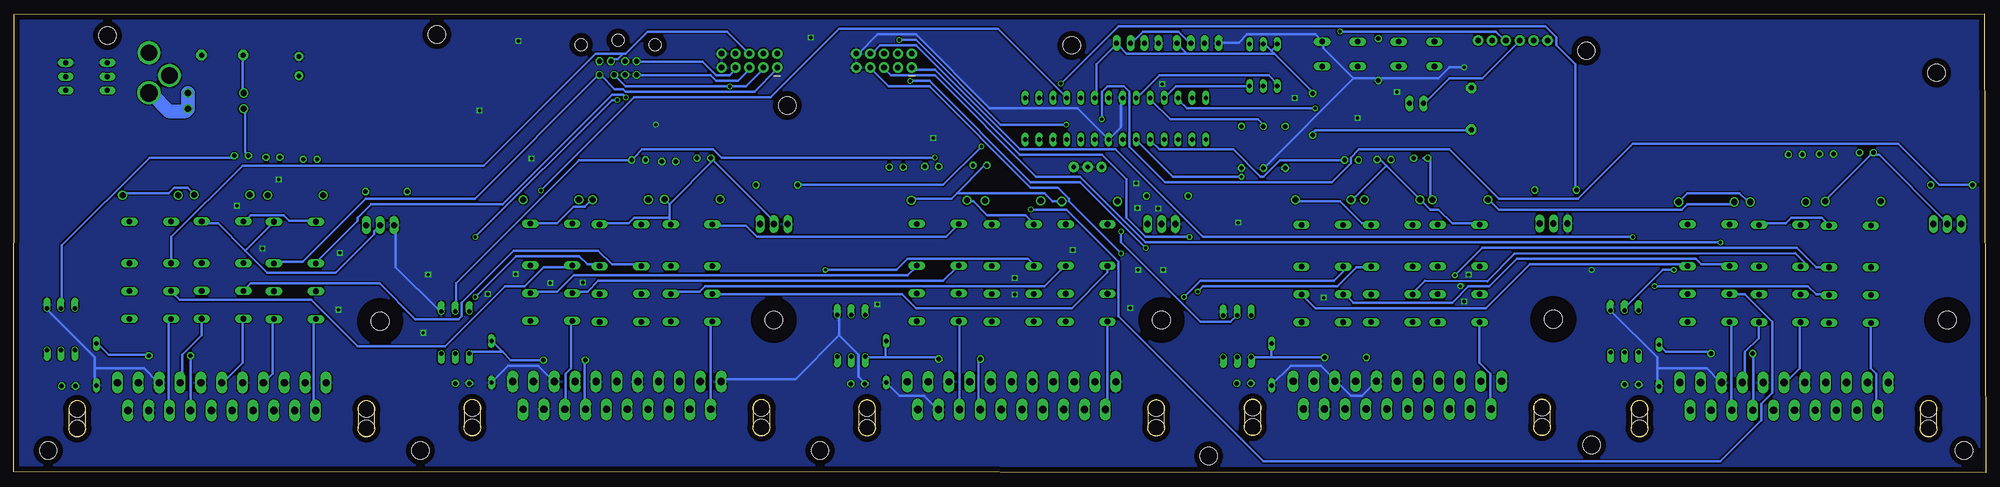
[diagram p7: board, bottom side, seen from below]

Size 360.32 x 83.88 mm. Coordinates in mm from the lower left corner, seen from the top.
Outline: 0,0 360.32,0.2 360.22,83.78 0.3,83.88 0,0
Copper layers (1*16): Top 0.035mm / dielectric 1.5mm / Bottom 0.035mm
Design rules "default": minimum track width 10mil, minimum drill 24mil, track to track 8mil, track to pad 8mil, pad to pad 8mil, via to via 8mil, smd to smd 8mil, copper to edge 40mil, drill to drill 8mil, minimum pad ring 10mil, minimum via ring 8mil, stop-mask expansion 4mil, vias tented up to drill 0mil, thermal gap 10mil
Holes 3.2 mm at 343.2,79.9 354,4.1 286,4.1 283,80.1 213,4.1 219,67.1 142,3.1 72,5.1 73,77.1 9,73.1 4,4.1 167,78.1

### Footprints (pad centres in the part's own frame; a part is rotated, then mirrored left to right if it is on the bottom)
C7.5B3 = drill 0.914 pad 1.905 octagon: 1 -3.81,0; 2 3.81,0
E3,5-10 = drill 0.813 pad 1.6: + -1.778,0 | drill 0.813 pad 1.6 octagon: - 1.778,0
DO41-10 = drill 1.118: A 5.08,0; C -5.08,0
DO34Z7 = drill 0.813 long: A 3.81,0; C -3.81,0
DIL28-3 = drill 0.813 long: 1 -16.51,-3.81; 2 -13.97,-3.81; 3 -11.43,-3.81; 4 -8.89,-3.81; 5 -6.35,-3.81; 6 -3.81,-3.81; 7 -1.27,-3.81; 8 1.27,-3.81; 9 3.81,-3.81; 10 6.35,-3.81; 11 8.89,-3.81; 12 11.43,-3.81; 13 13.97,-3.81; 14 16.51,-3.81; 15 16.51,3.81; 16 13.97,3.81; 17 11.43,3.81; 18 8.89,3.81; 19 6.35,3.81; 20 3.81,3.81; 21 1.27,3.81; 22 -1.27,3.81; 23 -3.81,3.81; 24 -6.35,3.81; 25 -8.89,3.81; 26 -11.43,3.81; 27 -13.97,3.81; 28 -16.51,3.81
6_PIN_SERIAL_TARGET_SIDE_W_SILK = drill 1.016 pad 1.88: P$1 -6.35,0; P$2 -3.81,0; P$3 -1.27,0; P$4 1.27,0; P$5 3.81,0; P$6 6.35,0
POWER_JACK_PTH_LOCK = drill 2.997 pad 4.115: GND 0.025,6.557; GNDBREAK 3.762,10.7 | drill 3.2 pad 4.115: PWR 0,13.878
2X5-SHROUDED = drill 1.016 pad 1.88: 1 -1.27,5.08; 2 1.27,5.08; 3 -1.27,2.54; 4 1.27,2.54; 5 -1.27,0; 6 1.27,0; 7 -1.27,-2.54; 8 1.27,-2.54; 9 -1.27,-5.08; 10 1.27,-5.08
JP2 = drill 0.914 long: 1 -2.54,0; 2 0,0; 3 2.54,0
JP4 = drill 0.914 long: 1 -3.81,0; 2 -1.27,0; 3 1.27,0; 4 3.81,0
JP1 = drill 0.914 long: 1 0,-1.27; 2 0,1.27
351 = drill 1.016 long: 1 -3.81,-3.81; 16 -3.81,3.81; O1 8.89,-3.81; O2 8.89,3.81; P1 3.81,-3.81; P2 3.81,3.81; S1 13.97,-3.81; S2 13.97,3.81
LED5MM = drill 0.813 octagon: A -1.27,0; K 1.27,0
DIL06 = drill 0.813 offset: 1 -2.54,-3.81; 2 0,-3.81; 3 2.54,-3.81; 4 2.54,3.81; 5 0,3.81; 6 -2.54,3.81
0204/7 = drill 0.813 octagon: 1 -3.81,0; 2 3.81,0
0204V = drill 0.813 octagon: 1 -1.27,0; 2 1.27,0
B3F-10XX = drill 1.016 long: 1 -3.251,2.261; 2 3.251,2.261; 3 -3.251,-2.261; 4 3.251,-2.261
EDG-03 = drill 0.813 long: 1 -2.54,-3.81; 2 0,-3.81; 3 2.54,-3.81; 4 2.54,3.81; 5 0,3.81; 6 -2.54,3.81
TO220 = drill 1.118 long: 1 -2.54,-6.35; 2 0,-6.35; 3 2.54,-6.35 | hole 3.302: 0,11.176
SCART-F = drill 1.321 long: 1 19.05,5.08; 2 17.145,0; 3 15.24,5.08; 4 13.335,0; 5 11.43,5.08; 6 9.525,0; 7 7.62,5.08; 8 5.715,0; 9 3.81,5.08; 10 1.905,0; 11 0,5.08; 12 -1.905,0; 13 -3.81,5.08; 14 -5.715,0; 15 -7.62,5.08; 16 -9.525,0; 17 -11.43,5.08; 18 -13.335,0; 19 -15.24,5.08; 20 -17.145,0; 21 -19.05,5.08 | hole 3.023: 26.416,0.254; 26.416,-3.302; -26.416,0.254; -26.416,-3.302
MDIN08SS = drill 0.9 octagon: 1 1.3,8.5; 2 -1.3,8.5; 3 3.4,8.5; 4 1.3,11; 5 -3.4,8.5; 6 3.4,11; 7 -0.7,11; 8 -3.4,11 | hole 2.2: -6.75,5.5; 0,4.7; 6.75,5.5
RESONATOR-PTH-7.6X3.8 = drill 0.8 pad 1.88: 1 -2.54,0; 2 0,0; 3 2.54,0

### Placement (x,y rotation side)
C1  94,66.5 90 top
C2  322.2,76.3 0 top
C3  308.2,74.3 90 top
D1  24.25,49.59 0 top
D2  37.95,49.49 0 top
D3  51.05,49.49 0 top
D4  96.05,49.89 0 top
D5  108.45,49.89 0 top
D6  121.05,49.89 0 top
D7  163.75,49.59 0 top
D8  177.75,49.69 0 top
D9  191.25,49.79 0 top
D10  236.35,49.99 0 top
D11  249.45,49.91 0 top
D12  262.15,49.91 0 top
D13  308.85,50.71 0 top
D14  322.25,50.81 0 top
D15  335.35,50.71 0 top
D16  323.4,69.4 0 top
D17  323.4,66.5 0 top
D18  59.7,19.6 270 top
D19  130.5,19.8 270 top
D20  200.9,20.3 270 top
D21  273,20.3 270 top
D22  345.2,19.8 270 top
IC1  159,64.7 0 top
J1  86.42,78.97 180 top
J2  335.6,83.3 180 top
J5  201.3,75.3 90 top
J6  225.9,75.3 90 top
JP3  343.2,72.4 90 top
JP4  350.8,72.4 90 top
JP5  144,78.5 180 top
JP6  155,78.5 180 top
JP7  104,67.5 90 top
K1  50.65,41.57 270 top
K2  37.65,41.49 270 top
K3  24.82,41.37 270 top
K4  121.22,41.49 270 top
K5  108.52,41.51 270 top
K6  96.32,41.53 270 top
K7  191.49,41.67 270 top
K8  177.79,41.59 270 top
K9  164.29,41.61 270 top
K10  262.09,41.73 270 top
K11  249.46,41.57 270 top
K12  236.46,41.59 270 top
K13  335.36,42.11 270 top
K14  322.16,42.13 270 top
K15  308.93,42.07 270 top
LED1  21.82,58.49 180 top
LED2  103.25,57.49 180 top
LED3  183.78,56.19 180 top
LED4  234.21,57.49 180 top
LED5  306.14,57.29 180 top
OK1  66.02,25.85 0 top
OK2  136.76,24.95 0 top
OK3  207.3,25.05 0 top
OK4  279.64,25.65 0 top
OK5  351.68,26.25 0 top
R1  6.26,52.59 0 top
R2  29.11,58.24 0 top
R3  64.73,16.14 0 top
R4  34.8,58.14 180 top
R5  78.6,51.69 0 top
R6  109.95,57.24 0 top
R7  135.56,16.36 0 top
R8  115.88,57.14 180 top
R9  149.54,50.59 0 top
R10  192.58,55.96 0 top
R11  206.1,16.26 0 top
R12  199.06,55.84 180 top
R13  220.88,52.59 0 top
R14  240.62,56.86 0 top
R15  278.34,16.36 0 top
R16  246.14,57.14 180 top
R17  292.22,51.39 0 top
R18  312.96,57.66 0 top
R19  350.28,15.86 0 top
R20  318.72,57.94 180 top
R21  123,65.5 90 top
R22  128,59.5 270 top
R23  132,59.5 270 top
R24  136,59.5 270 top
R25  111,75.5 270 top
R26  46.4,21.8 0 top
R27  117,21.1 0 top
R28  187.5,20.8 0 top
R29  259.7,20.6 0 top
R30  331.8,21.4 0 top
S1  118,76.5 180 top
S2  104,76.5 180 top
SW1  132,74.5 180 top
T1  7.05,39.11 180 top
T2  78.98,39.21 180 top
T3  150.61,39.11 180 top
T4  221.44,39.11 180 top
T5  293.37,38.91 180 top
X1  36.86,11.43 0 top
X2  107.51,11.66 0 top
X3  178,11.56 0 top
X4  250.11,11.61 0 top
X5  322.3,11.41 0 top
X6  249.9,83.7 180 top
Y1  164.1,55.9 0 top

### Tracks (layer width: path | path; a pad name or v marks a point on that pad's centre or on a via)
+5V
  Top 0.5: 30.37,58.01 R2.2 | 232.5,47.1 232.5,48.6 231.5,49.6 D10.C | 232.5,47.1 232.5,45.6 K12.1 | 244.5,57.1 242,57.1 R14.2 | 245.5,47.1 245.5,48.6 244.5,49.6 D11.C 244.5,50.1 244.5,53.6 | 245.5,47.1 245.5,45.6 K11.1 | 244.5,53.6 244.5,57.1 | 244.5,57.1 R16.2 | 245.5,47.1 232.5,47.1 | 257,52.6 257,50.1 D12.C 257.5,49.6 258,49.1 258,45.6 K10.1 | 257,52.6 257,53.6 | 257,53.6 257,71.6 253.5,75.1 X6.5 | 257,53.6 244.5,53.6 | C3.+ 308.5,72.1 315.5,72.1 318,69.6 D16.C 318.5,69.1 318.5,66.6 D17.C | JP4.1 350.5,70.1 343.5,70.1 JP3.1 343,69.6 326,52.6 | K15.1 305,46.1 305,49.6 304,50.6 D13.C 303.5,51.1 302,52.6 257,52.6 | K13.1 331.5,46.1 331.5,49.6 330.5,50.6 D15.C 330,51.1 329,51.1 327.5,52.6 326,52.6 | R18.2 314.5,57.6 317,57.6 R20.2 317.5,57.6 317.5,52.6 | K14.1 318,46.1 318,50.1 317.5,50.6 D14.C 317.5,51.1 317.5,52.6 | 317.5,52.6 326,52.6 | 20,48.6 19.5,49.1 D1.C | 20,48.6 21,47.6 21,45.6 K3.1 | K1.1 46.5,45.6 46.5,48.6 46,49.1 D3.C 45.5,49.6 44,51.1 32.5,51.1 | 32.5,58.1 30.5,58.1 R2.2 | 32.5,58.1 33.5,58.1 R4.2 | K2.1 33.5,45.6 33.5,48.6 33,49.1 D2.C 32.5,49.6 32.5,51.1 | 32.5,51.1 32.5,58.1 | 20,48.6 30,58.6 R2.2 | K6.1 92.5,45.6 92.5,48.1 91,49.6 D4.C | K4.1 117,45.6 117,48.6 116,49.6 D6.C | K5.1 104.5,45.6 104.5,48.6 103.5,49.6 D5.C | 112.5,57.6 114.5,57.6 R8.2 115,57.6 123.5,66.1 123.5,68.6 123,69.1 R21.2 | 112.5,57.6 111.5,57.6 R6.2 | 112.5,57.6 103,67.1 JP7.2 103,67.6 107,71.6 107,74.1 S2.1 | J6.4 223,76.6 221,76.6 J6.2 220.5,76.6 208.5,76.6 205,80.1 198,80.1 197.5,79.6 197.5,76.6 | 197.5,76.6 198.5,76.6 J5.4 | 197.5,76.6 196.5,76.6 J5.2 196,76.1 194.5,74.6 194.5,56.1 | 194.5,56.1 197.5,56.1 R12.2
  Top 0.5: 194.5,56.1 194,56.1 R10.2 | 187,49.1 186.5,49.6 D9.C | 187,49.1 187.5,48.6 187.5,45.6 K7.1 | 187,49.1 193.5,55.6 R10.2 | 194.5,56.1 R10.2 | K8.1 173.5,45.6 173.5,49.1 173,49.6 D8.C 172.5,50.1 170.5,50.1 169.5,51.1 158,51.1 | 158,51.1 158,50.1 158.5,49.6 D7.C 159,49.1 160,48.1 160,45.6 K9.1 | 158,51.1 158,60.6 IC1.7 158,61.1 158,62.6 162.5,67.1 162.5,68.1 IC1.20 | SW1.1 134.5,78.6 132,78.6 SW1.2
  Bottom 0.5: C2.1 318.5,76.1 318.5,69.6 D16.C | K15.1 305.5,46.1 310,46.1 311,47.1 317,47.1 318,46.1 K14.1 | D17.C 318,66.1 318,58.6 317.5,58.1 R20.2 | J1.P$4 85.5,78.6 92,72.1 98,72.1 102.5,67.6 JP7.2 | 109.5,56.1 111,57.6 R6.2 | 109.5,56.1 103.5,50.1 D5.C 103,49.6 101.5,48.1 100,48.1 97.5,45.6 93,45.6 K6.1 | 109.5,56.1 115.5,50.1 D6.C | D3.C 46,49.1 54.5,49.1 55.5,48.1 89,48.1 90.5,49.6 D4.C | IC1.20 162.5,68.6 162.5,74.6 159,78.1 JP6.1 158.5,78.1 157,76.6 146,76.6 | 130.5,77.1 132,78.6 SW1.2 | 130.5,77.1 130,76.6 | 130,76.6 123,69.6 R21.2 | 130.5,77.1 129.5,78.1 SW1.3 | 146,76.6 147.5,78.1 JP5.1 | 130,76.6 146,76.6 | D9.C 186,49.6 185,49.6 182.5,47.1 175.5,47.1 174,45.6 K8.1 | K12.1 232.5,45.1 226.5,45.1 224.5,43.1 190,43.1 188,45.1 K7.1
AUDIO_L-1
  Bottom 0.5: K1.S1 46.5,27.6 46.5,11.6 X1.6
AUDIO_L-3
  Bottom 0.5: K7.S1 187.5,27.6 187.5,11.6 X3.6
AUDIO_L-4
  Bottom 0.5: K10.S1 258.5,27.6 258.5,19.1 259.5,18.1 259.5,12.1 X4.6
AUDIO_L-5
  Bottom 0.5: K13.S1 332,28.1 332,11.6 X5.6
AUDIO_L_1
  Bottom 0.5: K1.P1 47,38.1 52,38.1 53,39.1 85.7,39.1 90.7,34.1 94.5,34.1 97.5,31.1 115.5,31.1 117,32.6 K4.O1
AUDIO_L_2  (via drill 0.61)
  Top 0.5: v146.5,32.1 157.5,32.1 159.5,30.1 185,30.1 K7.O1
  Bottom 0.5: v146.5,32.1 143.5,35.1 119.1,35.1 116.6,37.6 117.5,37.6 K4.P1
AUDIO_L_3
  Bottom 0.5: K10.O1 258,33.1 255.5,33.1 253.5,35.1 190.5,35.1 188,37.6 K7.P1
AUDIO_L_4
  Bottom 0.5: K10.P1 258.5,37.6 263.5,37.6 267,34.1 270.5,34.1 281.5,23.1 297.5,23.1 306,31.6 330,31.6 331.5,33.1 K13.O1
AUDIO_L_IN  (via drill 0.61)
  Top 0.5: v174.5,48.1 174.5,51.6 166.5,59.6 166.5,62.1 v168,63.6 | v198.5,79.1 201,76.6 J5.6
  Bottom 0.5: v174.5,48.1 168,48.1 158.5,38.6 158.5,28.6 132,2.1 48.5,2.1 41,9.6 41,12.6 39,14.6 39,27.6 44,32.6 46.5,32.6 K1.O1 | v168,63.6 180,63.6 195.5,79.1 v198.5,79.1
AUDIO_L_OUT
  Bottom 0.5: 249,76.6 250,75.6 251,75.6 X6.2 | 249,76.6 248.5,76.6 244.5,80.6 230,80.6 226,76.6 J6.6 | 249,76.6 254,76.6 274.5,56.1 318.5,56.1 331.5,43.1 331.5,38.6 K13.P1
AUDIO_R-1
  Top 0.5: K1.S2 54,27.6 54,11.6 X1.2
AUDIO_R-2
  Top 0.5: K4.S2 125,27.1 125,12.1 X2.2
AUDIO_R-3
  Top 0.5: K7.S2 195.5,27.6 195.5,11.6 X3.2
AUDIO_R-4
  Top 0.5: K10.S2 266,27.6 266,19.1 267,18.1 267,12.1 X4.2
AUDIO_R-5
  Top 0.5: K13.S2 339.5,28.1 339.5,11.6 X5.2
AUDIO_R_1
  Bottom 0.5: K1.P2 54.5,38.1 83.3,38.1 91.3,30.1 122.5,30.1 125,32.6 K4.O2
AUDIO_R_2
  Top 0.5: K4.P2 125.5,38.1 158,38.1 159,39.1 177.5,39.1 182.5,34.1 194,34.1 195,33.1 K7.O2
AUDIO_R_3
  Bottom 0.5: K10.O2 265.5,33.1 261,33.1 258,36.1 197,36.1 195.5,37.6 K7.P2
AUDIO_R_4
  Top 0.5: K10.P2 266,37.6 303,37.6 305,35.6 337,35.6 339,33.6 K13.O2
AUDIO_R_IN  (via drill 0.61)
  Top 0.5: v64.5,43.1 54.5,33.1 K1.O2
  Bottom 0.5: v64.5,43.1 143,43.1 159,59.1 176.5,59.1 195.5,78.1 202,78.1 203.5,76.6 J5.8
AUDIO_R_OUT
  Top 0.5: 248.5,76.6 248.5,75.6 X6.1 | 248.5,76.6 244.5,80.6 232.5,80.6 228.5,76.6 J6.8 | 248.5,76.6 254,76.6 255,75.6 281,75.6 305.5,51.1 305.5,50.6 311.5,44.6 328,44.6 334,38.6 339,38.6 K13.P2
BLUE-1
  Bottom 0.5: K2.S2 41.5,27.1 41.5,24.6 44,22.1 44,16.6 X1.7
BLUE-3
  Top 0.5: K8.S2 182,27.6 182,20.6 185.5,17.1 X3.7
BLUE-4
  Top 0.5: K11.S2 253.5,27.6 253.5,21.1 257.5,17.1 X4.7
BLUE-5
  Bottom 0.5: K14.S2 326,28.1 326,25.1 329.5,21.6 329.5,16.6 X5.7
BLUE_2  (via drill 0.61)
  Top 0.5: v144,33.1 157.5,33.1 159.5,31.1 180,31.1 K8.O2
  Bottom 0.5: v144,33.1 143,34.1 118.5,34.1 115,37.6 112.5,37.6 K5.P2
BLUE_3
  Top 0.5: K11.O2 253,32.6 248.5,32.6 247,31.1 214,31.1 210.5,27.6 203,27.6 194,36.6 183,36.6 182,37.6 K8.P2
BLUE_4  (via drill 0.61)
  Top 0.5: v276,32.1 303.5,32.1 304,31.6 324,31.6 325.5,33.1 K14.O2
  Bottom 0.5: v276,32.1 268.5,39.6 257,39.6 255.5,38.1 253.5,38.1 K11.P2
BLUE_IN  (via drill 0.61)
  Top 0.5: v48.5,42.1 41.5,35.1 41.5,32.6 K2.O2
  Bottom 0.5: v48.5,42.1 153.5,42.1 165.5,54.1 173.5,54.1 192,72.6 200,72.6 201,73.6 J5.5
BLUE_OUT  (via drill 0.61)
  Top 0.5: v276,43.1 316.5,43.1 321,38.6 325.5,38.6 K14.P2 | v250,68.1 250,69.1 246.5,72.6 X6.6
  Bottom 0.5: X6.6 246.5,72.6 233,72.6 232,71.6 228,71.6 226,73.6 J6.5 | v276,43.1 251,68.1 v250,68.1
GND  (via drill 0.61)
  Top 0.5: 17.5,19.1 17.5,16.6 X1.21 | 17.5,19.1 17.5,22.1 5,34.6 5,45.1 T1.3 | X1.4 50,11.6 50,14.6 48.5,16.1 X1.5 48,16.6 45.5,19.1 38,19.1 | 38,19.1 36,19.1 33.5,16.6 X1.13 33,16.6 30,13.6 29,13.6 27.5,15.1 27.5,17.6 26,19.1 17.5,19.1 | 38,19.1 40.5,16.6 X1.9 | 96,29.1 96,24.6 88.5,17.1 X2.21 | 96,29.1 96,31.1 | 96,31.1 v96,34.1 | D18.A 60,16.1 63,16.1 R3.1 | v72,37.1 72,33.1 70,31.1 | OK1.4 70,31.1 | 70,31.1 96,31.1 | 149.5,76.6 142,76.6 140.5,78.1 JP5.4 | 149.5,76.6 151,78.1 JP6.4 | IC1.8 160.5,60.6 160.5,59.6 164,56.1 Y1.2 | 149.5,76.6 157.5,68.6 IC1.22 | v95.3,74.1 85,74.1 80.5,78.6 J1.P$6 | T3.3 148,45.6 146,45.6 136,55.6 R24.2 135.85,55.73 132.16,55.73 R23.2 131.98,55.73 128.11,55.73 R22.2 128,55.6 125.5,53.1 82,53.1 76.5,47.6 76.5,45.6 T2.3 | 331.5,72.6 326,72.6 | 326,72.6 320,72.6 317,75.6 308.5,75.6 C3.- | 326,72.6 326,76.1 C2.2 | 331.5,72.6 335.5,76.6 J2.GND 336,76.6 337.5,75.1 343,75.1 JP3.3 343.5,75.1 350.5,75.1 JP4.3 351,74.6 354,71.6 354,30.1 OK5.4 | 331.5,72.6 J2.GNDBREAK | D22.A 345.5,16.1 349,16.1 R19.1 | X5.4 335.5,11.6 335.5,14.6 334,16.1 X5.5 333.5,16.6 331,19.1 323.5,19.1 | 315.5,19.1 306,19.1 303.5,16.6 X5.21 303,16.6 295,16.6 282.5,29.1 OK4.4 282,29.1 275.5,22.6 275.5,16.6 | 315.5,19.1 318,16.6 X5.13 | 323.5,19.1 X5.9 | 315.5,19.1 323.5,19.1 | 263,14.1 263,15.6 262,16.6 X4.5 | 263,14.1 263,12.1 X4.4 | 263,14.1 256.5,14.1 254,16.6 X4.9 253.5,16.6 251,14.1 243.5,14.1 | 243.5,14.1 234,14.1 231.5,16.6 X4.21 | 243.5,14.1 246,16.6 X4.13 | 275.5,16.6 277,16.6 R15.1 | 275.5,16.6 273,16.6 D21.A | 231,75.6 230.5,76.1 J6.10 | 231,75.6 v243,63.6 247,63.6 251,67.6 251,69.1 249,71.1 249,72.6 X6.4
  Top 0.5: 231,75.6 231,74.1 J6.9 230.5,73.6 210.5,53.6 | J5.10 206.5,76.1 206.5,74.1 J5.9 206.5,73.6 206.5,57.6 210.5,53.6 | OK3.4 210,29.1 210,36.6 218.5,45.1 T4.3 218.5,45.6 210.5,53.6 | R11.1 204.5,16.6 201,16.6 D20.A | X3.4 191,11.6 191,15.1 189.5,16.6 X3.5 189,16.6 186.5,14.1 179,14.1 | 171.5,14.1 161.5,14.1 159,16.6 X3.21 158.5,17.1 149.5,17.1 139,27.6 | 171.5,14.1 174,16.6 X3.13 | 179,14.1 181.5,16.6 X3.9 | 171.5,14.1 179,14.1 | 133,16.1 134,16.1 R7.1 | 133,16.1 130.5,16.1 D19.A | 139,27.6 139,28.6 OK2.4 | 139,27.6 133,21.6 133,16.1 | X2.4 120.5,12.1 120.5,15.1 119,16.6 X2.5 119,17.1 107,29.1 96,29.1 | X2.13 104,16.6 106.5,14.1 108.5,14.1 111,16.6 X2.9
  Bottom 0.5: 60,19.1 60,21.1 OK1.4 | 60,19.1 60,16.1 D18.A | 60,19.1 51,19.1 48.5,16.6 X1.5 | IC1.22 158,68.1 158,63.1 160,61.1 IC1.8 160.5,61.1 166,66.6 182,66.6 195.5,80.1 202.5,80.1 206,76.6 J5.10 | 115.5,72.1 111,72.1 | 115.5,72.1 121,77.6 121,78.6 S1.3 121.5,79.1 122.5,80.1 135,80.1 136.5,78.6 140,78.6 JP5.4 | 115.5,72.1 132,55.6 R23.2 | v95.3,74.1 98,74.1 100,72.1 111,72.1 | 111,72.1 R25.2 | 345.5,19.1 345.5,16.1 D22.A | 345.5,19.1 345.5,21.1 354,29.6 OK5.4 | 345.5,19.1 336.5,19.1 334,16.6 X5.5 | T5.3 290.5,45.1 290.5,37.6 282.5,29.6 OK4.4 | X4.5 262,17.1 264.5,19.6 270,19.6 273,16.6 D21.A | D20.A 200.5,16.1 198.5,14.1 194,14.1 191.5,11.6 X3.4 | X2.9 111.5,16.6 114,14.1 116,14.1 118.5,16.6 X2.5 119,17.1 121.5,19.6 127,19.6 130.5,16.1 D19.A | 209.5,25.1 209.5,28.6 OK3.4 | 209.5,25.1 206,21.6 206,17.6 205,16.6 R11.1 | 209.5,25.1 217.5,17.1 231,17.1 X4.21
  other vias: 150.3,37.1 154.9,37.1 177.4,32.6 177.4,35.6 166.8,40.7 136.6,45.7 94.5,36.2 95.3,31.3 121,32 155,48.4 155.2,52.9 192.3,61.2 202.5,30.8 151.2,48.3 156.3,30.1 107.6,69.6 114.8,64.8 126.3,68.5 150.5,71 301,29.8 285.5,25.6 268.6,36.3 273.7,32.7 284.6,36.2 265.7,57.4 275.2,66.2 268.1,78.9 300.7,40.2 311.9,53.6 319.5,48.8 314.9,41 256.3,34.8 262.3,34.7 214.7,79.5
  pour Top: 0.2,83.9 360.2,83.9 360.2,0.2 0.2,0.2
  pour Bottom: 0.2,83.8 360.2,83.8 360.2,0.2 0.2,0.2
GREEN-1
  Bottom 0.5: K2.S1 34,27.1 34,19.1 36.5,16.6 X1.11
GREEN-2
  Top 0.5: K5.S1 105,27.1 105,19.6 107.5,17.1 X2.11
GREEN-3
  Top 0.5: K8.S1 174,27.6 174,21.1 178,17.1 X3.11
GREEN-4
  Top 0.5: K11.S1 246,27.6 246,21.1 250,17.1 X4.11
GREEN-5
  Bottom 0.5: K14.S1 318.5,28.1 318.5,20.1 322,16.6 X5.11
GREEN_1
  Bottom 0.5: K2.P1 34,38.1 32.8,38.1 34.8,40.1 86.1,40 91.1,35 102.5,35.1 104.5,33.1 K5.O1
GREEN_2
  Top 0.5: K5.P1 105,37.6 109.5,37.6 111,36.1 170.5,36.1 173.5,33.1 K8.O1
GREEN_3  (via drill 0.61)
  Top 0.5: v212,37.1 214,35.1 240.5,35.1 242.5,33.1 245.5,33.1 K11.O1
  Bottom 0.5: v212,37.1 199,37.1 197,39.1 175,39.1 174,38.1 K8.P1
GREEN_4
  Bottom 0.5: K11.P1 246,38.1 251,38.1 253.5,40.6 269,40.6 278.5,31.1 278.5,28.6 279,28.1 287,28.1 293.5,34.6 317,34.6 318,33.6 K14.O1
GREEN_IN  (via drill 0.61)
  Top 0.5: K2.O1 38.5,32.6 40,31.1 60,31.1 70,41.1 v153.5,41.1 | v196.5,71.6 198.5,73.6 J5.3
  Bottom 0.5: v153.5,41.1 165.5,53.1 174.5,53.1 193,71.6 v196.5,71.6
GREEN_OUT  (via drill 0.61)
  Top 0.5: v229.5,70.6 229.5,45.6 233,42.1 311.5,42.1 315,38.6 318,38.6 K14.P1
  Bottom 0.5: X6.7 248.5,70.6 v229.5,70.6 226.5,70.6 223.5,73.6 J6.3
N$1
  Top 0.5: IC1.2 145,61.1 145,62.6 131.5,76.1 121,76.1 115.5,81.6 93,81.6 90.5,79.1 J1.P$2
N$2
  Top 0.5: K2.16 41.5,45.6 41.5,47.6 43,49.1 D2.A | K1.16 54.5,45.6 54.5,47.6 56,49.1 D3.A | K3.16 29,45.6 29,49.1 D1.A
  Bottom 0.5: 43.2,49.4 D2.A 43.5,49.6 45,51.1 54.5,51.1 56,49.6 D3.A | D1.A 29.5,49.6 21,58.1 LED1.K 20.5,58.1 19.5,58.1 7.5,46.1 7.5,45.6 T1.2 | K2.16 41,45.6 36.5,45.6 35.5,46.6 30,46.6 29,45.6 K3.16
N$3
  Top 0.5: LED1.A 23.5,58.6 27.5,58.6 R2.1
N$4
  Bottom 0.5: R26.1 42.5,21.6 42.5,11.6 X1.8
N$5
  Top 0.5: R3.2 66,21.6 OK1.2
N$6
  Top 0.5: K4.16 125.5,45.6 125.5,49.1 126,49.6 D6.A | D5.A 113.5,49.6 112.5,48.6 112.5,45.6 K5.16 112,45.1 107,45.1 106,44.1 99,44.1 | D4.A 101,49.6 100.5,49.1 100.5,45.6 K6.16 100,45.1 99,44.1 | 99,44.1 98,43.1 81,43.1 79,45.1 T2.2
  Bottom 0.5: 102.8,57.49 102.09,57.49 LED2.K 101.5,57.1 101.5,50.1 D4.A | D6.A 126,49.6 118,49.6 114,45.6 112.5,45.6 K5.16
N$7
  Top 0.5: R1.2 10,52.1 10,45.6 T1.1
N$8
  Top 0.5: LED2.A 105,57.6 108.5,57.6 R6.1
N$9
  Top 0.5: R5.2 82,51.6 82,45.6 T2.1
N$10  (via drill 0.61)
  Top 0.5: v118,80.6 134.5,80.6 136,79.1 136,72.6 147.5,61.1 IC1.3
  Bottom 0.5: v118,80.6 89.5,80.6 88,79.1 J1.P$3
N$11
  Top 0.5: R27.1 113.5,21.1 113.5,12.1 X2.8
N$12
  Top 0.5: R7.2 137,16.6 137,21.1 OK2.2
N$13
  Top 0.5: D7.A 168.5,49.1 168.5,45.6 K9.16 163.2,45.4 160.9,43.1 152.5,43.1 151,44.6 151,45.1 T3.2 | K7.16 195.5,45.6 195.5,49.1 196,49.6 D9.A | LED3.K 182.5,56.1 182.5,50.1 D8.A 182.5,49.6 182,49.1 182,45.6 K8.16
  Bottom 0.5: 188,51.1 183,56.1 LED3.K | 188,51.1 189,50.1 196,50.1 D9.A | 188,51.1 172,51.1 170.5,49.6 169,49.6 D7.A
N$14
  Top 0.5: LED3.A 185.5,56.1 191,56.1 R10.1
N$15
  Top 0.5: R9.2 153.5,50.1 153.5,45.6 T3.1
N$16
  Bottom 2.54: J2.PWR 335.32,69.42 332,66.1 328.88,66.1 D17.A D16.A
N$17
  Bottom 0.5: R28.1 184,20.6 184,11.6 X3.8
N$18
  Top 0.5: R11.2 207.5,16.6 207.5,21.1 OK3.2
N$19
  Top 0.5: K10.16 266,45.6 266,48.6 267,49.6 D12.A | K11.16 253.5,45.6 253.5,48.6 254.5,49.6 D11.A
  Bottom 0.5: K10.16 265.5,45.6 261,45.6 258,48.6 256,48.6 255,49.6 D11.A | 240.5,49.1 240.5,46.6 | 240.5,46.6 240.5,45.6 K12.16 | 240.5,49.1 241,49.6 D10.A | 232.5,57.1 221,45.6 T4.2 | 232.5,57.1 240.5,49.1 | 232.5,57.1 LED4.K | 240.5,46.6 247,46.6 248,45.6 253,45.6 K11.16
N$20
  Top 0.5: LED4.A 235.5,57.1 239,57.1 R14.1
N$21
  Top 0.5: R13.2 224.5,52.1 224.5,46.1 224,45.6 T4.1
N$22
  Top 0.5: J1.P$1 93,78.6 96.5,75.1 96.5,73.1 94,70.6 C1.2
N$23
  Bottom 0.5: R29.1 256,20.6 256,12.1 X4.8
N$24
  Top 0.5: R15.2 279.5,16.6 279.5,21.6 OK4.2
N$25
  Top 0.5: 308,50.6 312.5,46.1 K15.16 | 308,50.6 305,53.6 305,57.1 LED5.K | 308,50.6 313.5,50.6 D13.A | K13.16 339.5,46.1 339.5,50.1 340,50.6 D15.A | K14.16 326,46.1 326,49.6 327,50.6 D14.A
  Bottom 0.5: 318,40.6 323,45.6 325.5,45.6 K14.16 | 318,40.6 314,36.6 301.5,36.6 294.5,43.6 294.5,44.1 293.5,45.1 T5.2 | D15.A 340,51.1 332,51.1 331,52.1 328.5,52.1 327.5,51.1 D14.A | 318,40.6 313,45.6 K15.16
N$26
  Top 0.5: LED5.A 307.5,57.6 311.5,57.6 R18.1
N$27
  Top 0.5: R17.2 296,51.1 296,45.6 T5.1
N$29
  Bottom 0.5: R30.1 328,21.1 328,11.6 X5.8
N$30
  Top 0.5: R19.2 351.5,16.1 351.5,22.1 OK5.2
N$31
  Top 0.5: IC1.9 162.5,61.1 160.5,63.1 160,63.1 159,62.1 159,58.6 161.5,56.1 Y1.1
N$32
  Top 0.5: IC1.10 165.5,60.6 165.5,57.1 166.5,56.1 Y1.3
N$33  (via drill 0.61)
  Top 0.5: 109.5,79.1 107.5,79.1 S2.3 | 109.5,79.1 111,79.1 R25.1 | 109.5,66.6 106,66.6 105.5,67.1 JP7.1 | 109.5,66.6 v122.5,66.6 | 109.5,66.6 109.5,79.1
  Bottom 0.5: v122.5,66.6 146,66.6 147.5,68.1 IC1.26
N$34
  Top 0.5: R24.1 136,69.6 135,70.6 SW1.6
  Bottom 0.5: IC1.25 150,68.6 148,70.6 135,70.6 SW1.6
N$35
  Top 0.5: SW1.5 R23.1
  Bottom 0.5: IC1.24 152.5,68.1 149,64.6 133,64.6 132,63.6 R23.1
N$36
  Top 0.5: R22.1 128,69.6 129,70.6 SW1.4
  Bottom 0.5: IC1.23 155,68.6 151,72.6 131,72.6 129.5,71.1 SW1.4
N$38
  Top 0.5: OK5.1 349,22.6 346.5,22.6 345.5,23.6 D22.C
  Bottom 0.5: R30.2 336,21.6 343,21.6 345,23.6 D22.C
N$39
  Top 0.5: IC1.27 145.5,68.1 147,66.6 158.5,66.6 159,67.1 159,75.6 156.5,78.1 JP6.2
  Bottom 0.5: JP5.2 145.5,78.6 147.5,80.6 154,80.6 156,78.6 JP6.2
N$40
  Top 0.5: 140.5,80.6 139.5,80.6 139,80.1 139,77.1 142,74.1 142,68.6 IC1.28 | 140.5,80.6 142.5,78.6 JP5.3 | 140.5,80.6 151.5,80.6 153.5,78.6 JP6.3
N$41
  Bottom 0.5: R29.2 269.5,20.6 271,22.1 | 271,22.1 D21.C | 271,22.1 277,22.1 OK4.1
N$42
  Bottom 0.5: 201,21.1 204.5,21.1 OK3.1 | 201,21.1 191.5,21.1 R28.2 | 201,21.1 201,24.1 D20.C
N$43
  Top 0.5: OK1.1 63,22.1 61,22.1 60,23.1 D18.C
  Bottom 0.5: R26.2 50.5,22.1 58.5,22.1 59.5,23.1 D18.C
N$44
  Bottom 0.5: 130.5,21.1 134,21.1 OK2.1 | 130.5,21.1 R27.2 | 130.5,21.1 D19.C
R_1  (via drill 0.61)
  Top 0.5: v161.5,64.6 172,64.6 175.5,61.1 IC1.14
  Bottom 0.5: v161.5,64.6 161.5,69.6 160.5,70.6 157.5,70.6 156.5,69.6 156.5,59.6 150,53.1 119.5,53.1 116,56.6 116,57.6 114.5,59.1 98,59.1 89,50.1 74.5,50.1 64.5,60.1 16,60.1 8.5,52.6 2.5,52.6 R1.1
R_2  (via drill 0.61)
  Top 0.5: v169,71.1 173,71.1 175.5,68.6 IC1.15
  Bottom 0.5: v169,71.1 158.5,81.6 80.5,81.6 78.5,79.6 78.5,78.1 75,74.6 75,52.1 R5.1
R_3
  Top 0.5: R9.1 146,50.6 146,54.1 151.5,59.6 151.5,62.1 155,65.6 160,65.6 161.5,67.1 161.5,69.6 164,72.1 174.5,72.1 177,69.6 177,67.6 176,66.6 174.5,66.6 173,68.1 IC1.16
R_4  (via drill 0.61)
  Top 0.5: v183.5,59.6 179.5,59.6 170.5,68.6 IC1.17
  Bottom 0.5: v183.5,59.6 190.5,52.6 217,52.6 R13.1
R_5  (via drill 0.61)
  Top 0.5: v264,51.6 288,51.6 R17.1
  Bottom 0.5: v264,51.6 247,68.6 222,68.6 209.5,81.1 180.5,81.1 168,68.6 IC1.18
RED-1
  Top 0.5: K3.S2 29,27.1 29,16.6 X1.15
RED-2
  Top 0.5: K6.S2 100,27.1 100,17.1 X2.15
RED-3
  Top 0.5: K9.S2 168.5,27.6 168.5,18.6 170,17.1 X3.15
RED-4
  Top 0.5: K12.S2 240.5,27.6 240.5,18.6 242,17.1 X4.15
RED-5
  Bottom 0.5: K15.S2 313,28.1 313,18.1 314.5,16.6 X5.15
RED_1  (via drill 0.61)
  Top 0.5: v97,36.1 100,33.1 K6.O2
  Bottom 0.5: v97,36.1 92,41.1 34.5,41.1 31,37.6 29,37.6 K3.P2
RED_2
  Top 0.5: K6.P2 100.5,37.6 102,37.6 104.5,35.1 166,35.1 168,33.1 K9.O2
RED_3
  Bottom 0.5: K12.O2 240,33.1 235,33.1 234,34.1 172,34.1 168.5,37.6 K9.P2
RED_4
  Top 0.5: K12.P2 240.5,38.1 243.5,38.1 245,39.6 261.5,39.6 266,35.1 304.5,35.1 305,34.6 311.5,34.6 312.5,33.6 K15.O2
RED_IN  (via drill 0.61)
  Top 0.5: v60.5,34.1 62,34.1 70,42.1 144.5,42.1 v145.5,43.1
  Bottom 0.5: v60.5,34.1 32.5,34.1 31,32.6 29,32.6 K3.O2 | v145.5,43.1 153.5,43.1 157,46.6 157,53.6 161.5,58.1 176.5,58.1 192,73.6 196,73.6 J5.1
RED_OUT
  Bottom 0.5: J6.1 221,73.6 225,69.6 248.5,69.6 249,70.1 250.5,70.1 253,72.6 X6.8 253.5,72.6 276,50.1 296,50.1 307.5,38.6 312.5,38.6 K15.P2
RESET
  Top 0.5: 124.5,61.6 141.5,61.6 142,61.1 IC1.1 | 124.5,61.6 123,61.6 R21.1 | 124.5,61.6 124.5,69.6 121.5,72.6 121.5,74.1 S1.1
  Bottom 0.5: C1.1 94,62.6 122.5,62.6 123,62.1 R21.1
S_1  (via drill 0.61)
  Top 0.5: 57,40.1 v57,37.1 | 57,40.1 47.5,49.6 47.5,50.1 39.5,58.1 36.5,58.1 R4.1 | 57,40.1 71,54.1 116,54.1 119,57.1 146.5,57.1 150,60.6 IC1.4
  Bottom 0.5: v57,37.1 59,37.1 66,30.1 OK1.5
S_2  (via drill 0.61)
  Top 0.5: v158,44.1 158,48.1 153,53.1 153,60.6 IC1.5
  Bottom 0.5: v158,44.1 158,42.1 143.5,27.6 138,27.6 137,28.6 OK2.5 | R8.1 117.5,57.1 129,57.1 132,54.1 132.5,54.1 137.5,59.1 151,59.1 152.5,60.6 IC1.5
S_3  (via drill 0.61)
  Top 0.5: v136,54.1 148,42.1 194.5,42.1 200,36.6 | 200,36.6 207.5,29.1 OK3.5 | 200,36.6 200,55.6 R12.1
  Bottom 0.5: v136,54.1 148.5,54.1 155,60.6 IC1.6
S_4  (via drill 0.61)
  Top 0.5: v192,57.6 171,57.6 168,60.6 IC1.11
  Bottom 0.5: OK4.5 279.5,29.6 279.5,34.6 257,57.1 247.5,57.1 R16.1 247,57.6 245.5,59.1 232.5,59.1 231,57.6 v192,57.6
S_5
  Top 0.5: IC1.12 170.5,60.6 172.5,58.6 184,58.6 191,65.6 191,74.1 198.5,81.6 277,81.6 299.5,59.1 318.5,59.1 319.5,58.1 R20.1
  Bottom 0.5: R20.1 320,57.6 335.5,57.6 351.5,41.6 351.5,30.1 OK5.5
SYNC-1
  Bottom 0.5: K3.S1 21,27.1 21,19.1 20,18.1 20,11.6 X1.20
SYNC-2
  Bottom 0.5: K6.S1 92.5,27.1 92.5,20.1 90.5,18.1 90.5,12.1 X2.20
SYNC-3
  Bottom 0.5: K9.S1 160.5,27.6 160.5,11.6 X3.20
SYNC-4
  Bottom 0.5: K12.S1 233,27.6 233,12.1 X4.20
SYNC-5
  Bottom 0.5: K15.S1 305.5,28.1 305.5,11.6 X5.20
SYNC_1
  Top 0.5: K3.P1 21,37.1 21,35.1 19,33.1 19,31.6 21.5,29.1 60,29.1 69,38.1 87.5,38.1 92.5,33.1 K6.O1
SYNC_2
  Top 0.5: K6.P1 93,37.6 97.5,37.6 101,34.1 159,34.1 160,33.1 K9.O1
SYNC_3
  Bottom 0.5: K12.O1 232.5,32.6 198,32.6 195.5,30.1 167,30.1 160.48,36.62 K9.P1
SYNC_4
  Top 0.5: K12.P1 233,37.6 237.5,37.6 239,36.1 264,36.1 266,34.1 304.5,34.1 305,33.6 K15.O1
SYNC_IN  (via drill 0.61)
  Top 0.5: v158,40.1 70,40.1 60,30.1 28.5,30.1 26.5,32.1 21.5,32.1 K3.O1
  Bottom 0.5: v158,40.1 167.5,49.6 167.5,50.1 169.5,52.1 174.5,52.1 193,70.6 200.5,70.6 203.5,73.6 J5.7
SYNC_OUT  (via drill 0.61)
  Top 0.5: v248.5,68.6 245,72.1 245,73.6 246.5,75.1 X6.3
  Bottom 0.5: X6.3 246.5,75.1 234.5,75.1 232,72.6 229.5,72.6 228.5,73.6 J6.7 | v248.5,68.6 249,69.1 251,69.1 271,49.1 295,49.1 297.5,46.6 297.5,46.1 305,38.6 K15.P1

### Text on the board
Top: SCART SWITCH 5CH - REV1 | KENJI - 2018 | RGBS / RGsB / EURO SCART ONLY
tPlace: RGB IN | RGB OUT | RGB-MINI_FM OUT